# EAGLE design main_brd (EAGLE 6.4)
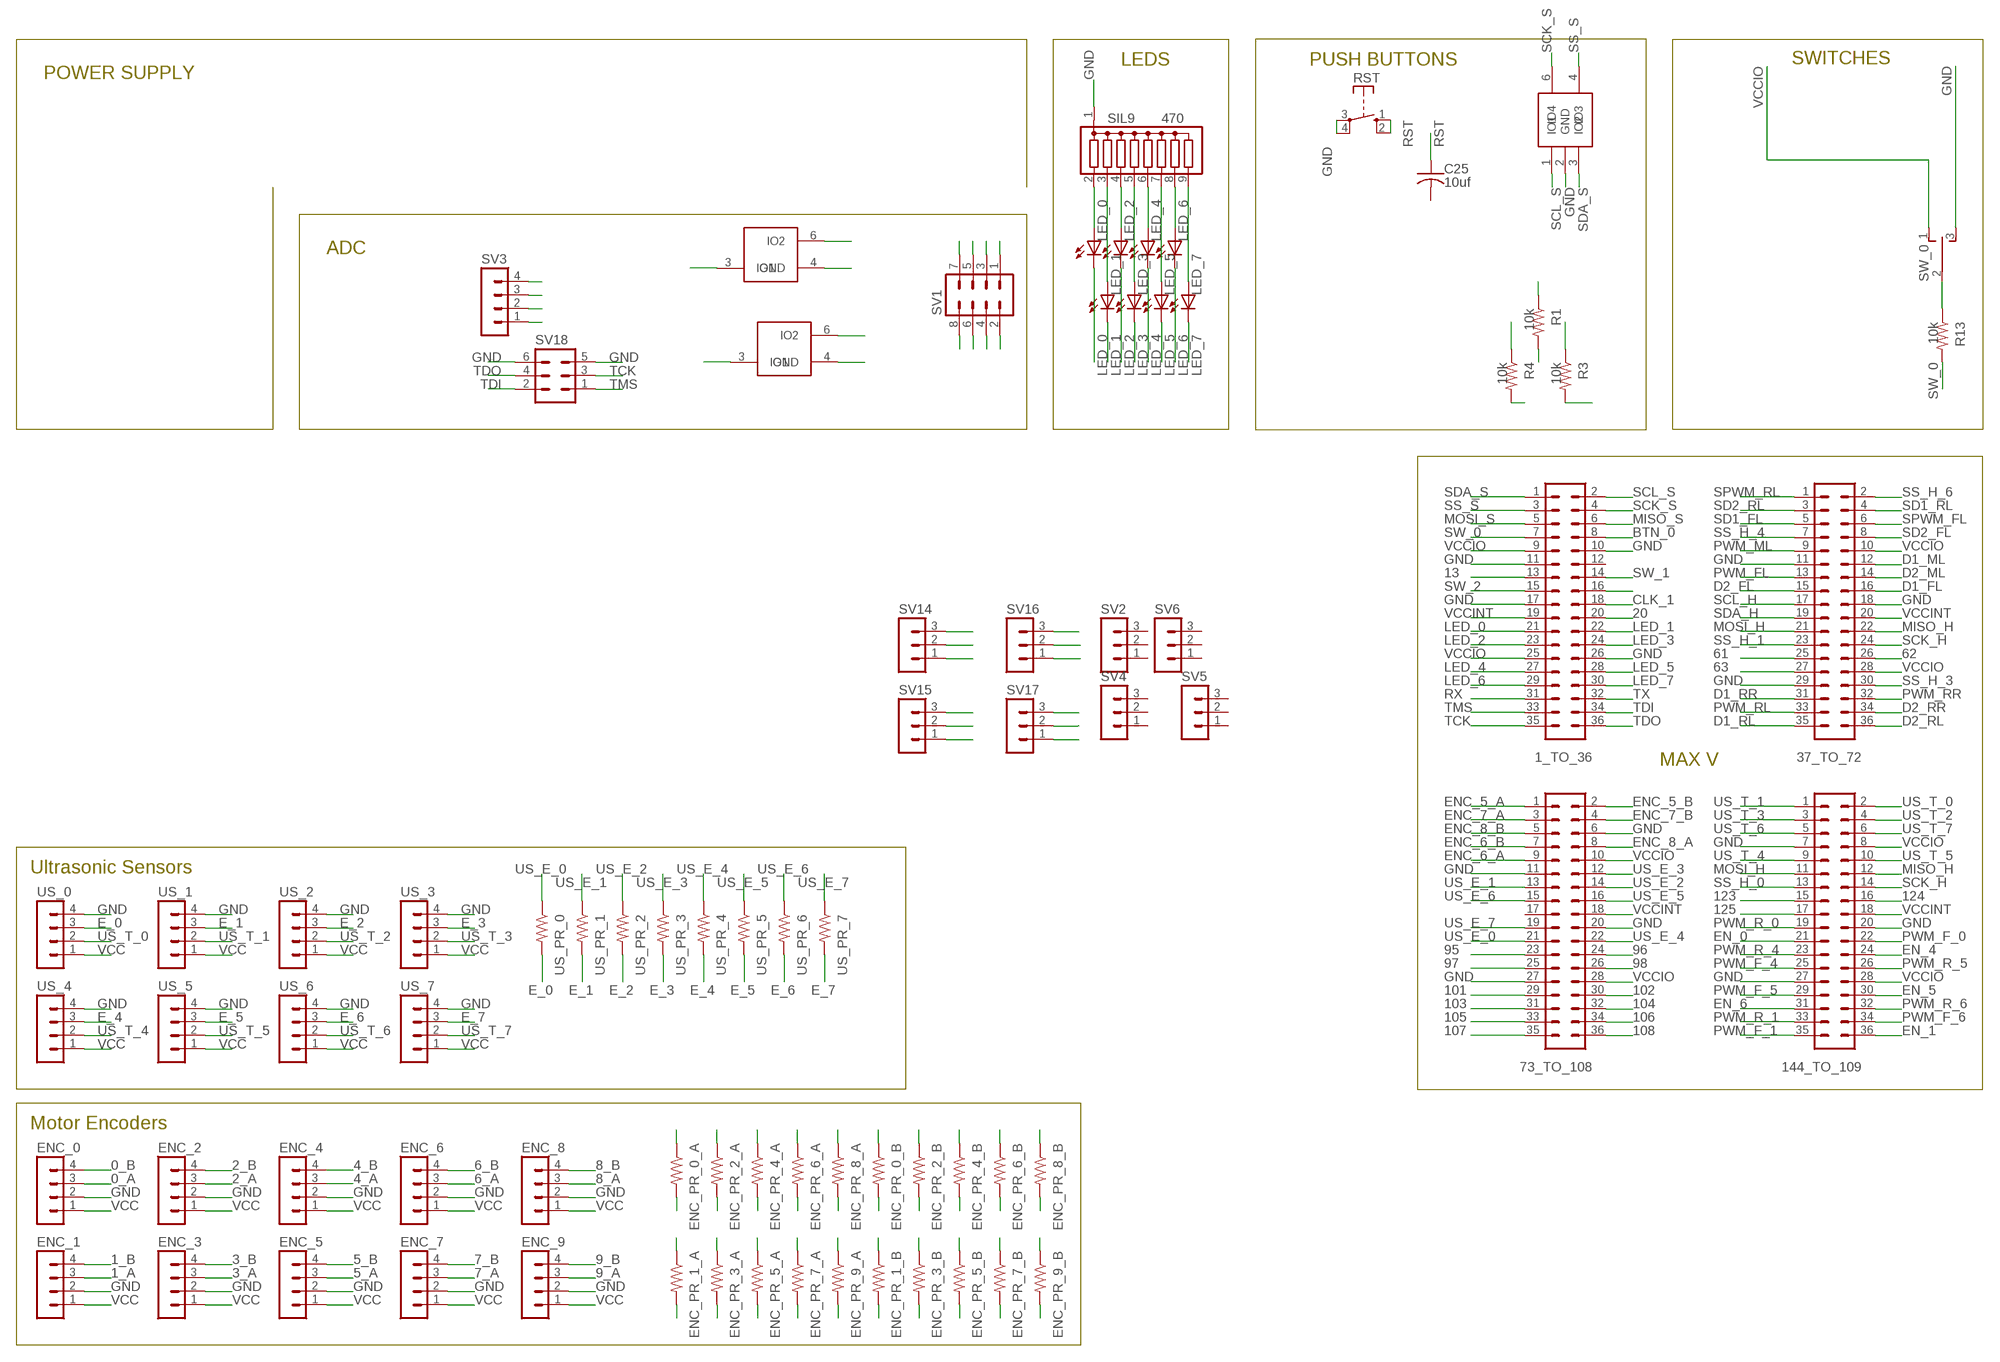
[diagram p0: schematic, sheet 1, part 1 of 2]
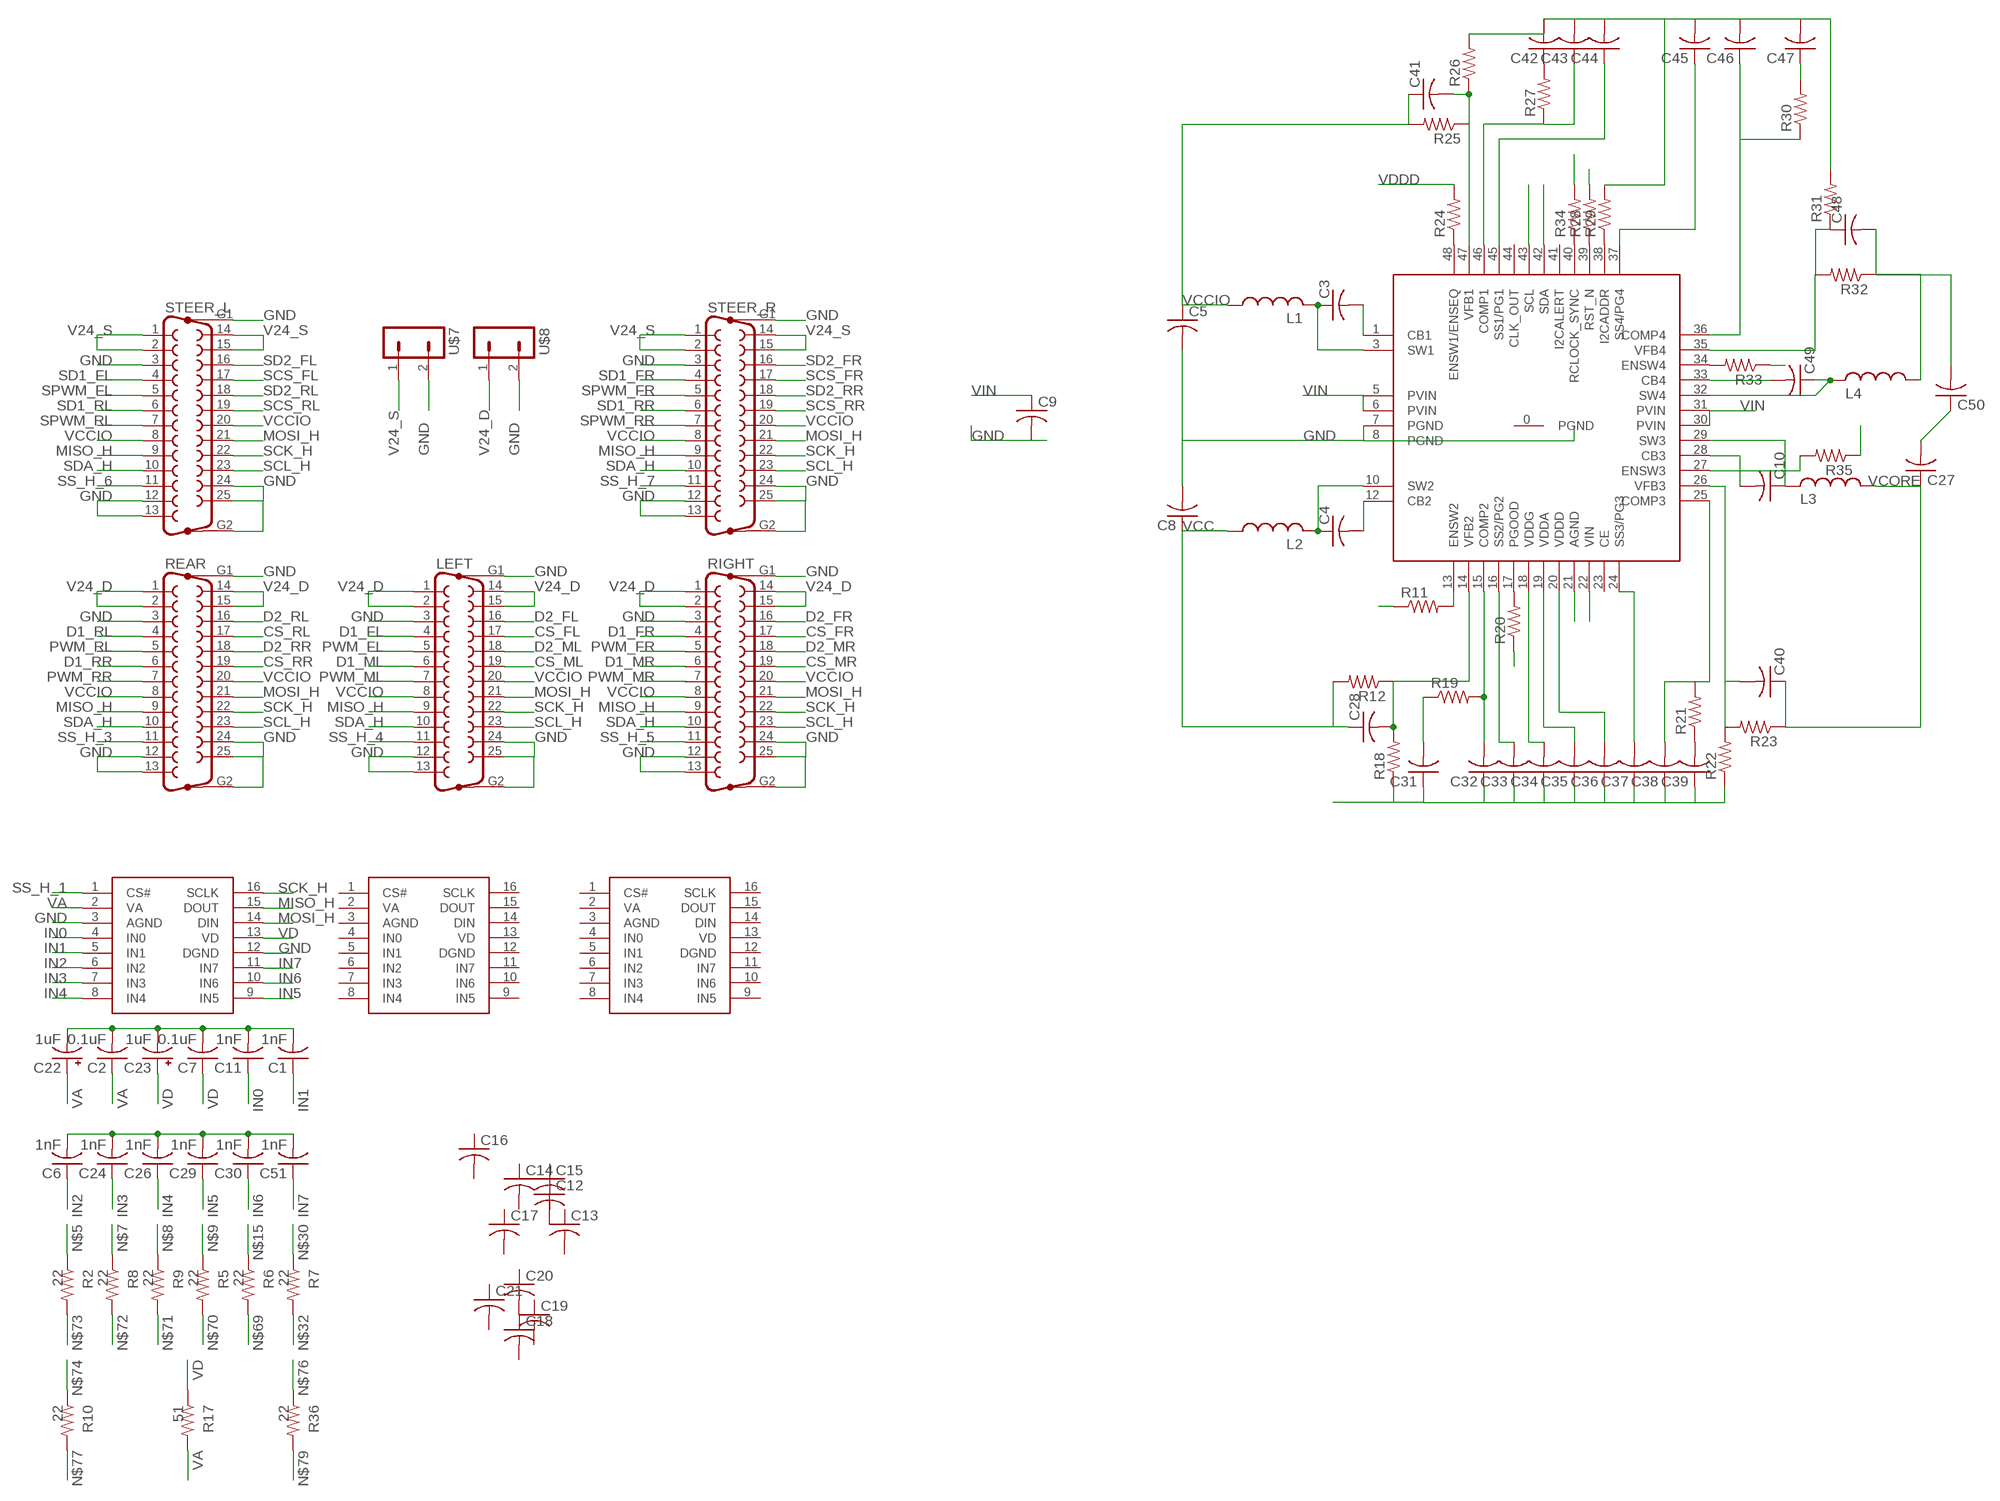
[diagram p1: schematic, sheet 1, part 2 of 2]

## Parts
1_TO_36  MA18-2  [MA18-2]
37_TO_72  MA18-2  [MA18-2]
73_TO_108  MA18-2  [MA18-2]
144_TO_109  MA18-2  [MA18-2]
C1  1nF  C-USC1206  [C1206]
C2  0.1uF  C-USC1206  [C1206]
C3  C-USC1206  [C1206]
C4  C-USC1206  [C1206]
C5  C-USC1206  [C1206]
C6  1nF  C-USC1206  [C1206]
C7  0.1uF  C-USC1206  [C1206]
C8  C-USC1206  [C1206]
C9  C-USC1206  [C1206]
C10  C-USC1206  [C1206]
C11  1nF  C-USC1206  [C1206]
C12  C-USC1206  [C1206]
C13  C-USC1206  [C1206]
C14  C-USC1206  [C1206]
C15  C-USC1206  [C1206]
C16  C-USC1206  [C1206]
C17  C-USC1206  [C1206]
C18  C-USC1206  [C1206]
C19  C-USC1206  [C1206]
C20  C-USC1206  [C1206]
C21  C-USC1206  [C1206]
C22  1uF  CPOL-USE1.8-4  [E1,8-4]
C23  1uF  CPOL-USE1.8-4  [E1,8-4]
C24  1nF  C-USC1206  [C1206]
C25  10uf  C-USC1206  [C1206]
C26  1nF  C-USC1206  [C1206]
C27  C-USC1206  [C1206]
C28  C-USC1206  [C1206]
C29  1nF  C-USC1206  [C1206]
C30  1nF  C-USC1206  [C1206]
C31  C-USC1206  [C1206]
C32  C-USC1206  [C1206]
C33  C-USC1206  [C1206]
C34  C-USC1206  [C1206]
C35  C-USC1206  [C1206]
C36  C-USC1206  [C1206]
C37  C-USC1206  [C1206]
C38  C-USC1206  [C1206]
C39  C-USC1206  [C1206]
C40  C-USC1206  [C1206]
C41  C-USC1206  [C1206]
C42  C-USC1206  [C1206]
C43  C-USC1206  [C1206]
C44  C-USC1206  [C1206]
C45  C-USC1206  [C1206]
C46  C-USC1206  [C1206]
C47  C-USC1206  [C1206]
C48  C-USC1206  [C1206]
C49  C-USC1206  [C1206]
C50  C-USC1206  [C1206]
C51  1nF  C-USC1206  [C1206]
ENC_0  MA04-1  [MA04-1]
ENC_1  MA04-1  [MA04-1]
ENC_2  MA04-1  [MA04-1]
ENC_3  MA04-1  [MA04-1]
ENC_4  MA04-1  [MA04-1]
ENC_5  MA04-1  [MA04-1]
ENC_6  MA04-1  [MA04-1]
ENC_7  MA04-1  [MA04-1]
ENC_8  MA04-1  [MA04-1]
ENC_9  MA04-1  [MA04-1]
ENC_PR_0_A  R-US_R1206  [R1206]
ENC_PR_0_B  R-US_R1206  [R1206]
ENC_PR_1_A  R-US_R1206  [R1206]
ENC_PR_1_B  R-US_R1206  [R1206]
ENC_PR_2_A  R-US_R1206  [R1206]
ENC_PR_2_B  R-US_R1206  [R1206]
ENC_PR_3_A  R-US_R1206  [R1206]
ENC_PR_3_B  R-US_R1206  [R1206]
ENC_PR_4_A  R-US_R1206  [R1206]
ENC_PR_4_B  R-US_R1206  [R1206]
ENC_PR_5_A  R-US_R1206  [R1206]
ENC_PR_5_B  R-US_R1206  [R1206]
ENC_PR_6_A  R-US_R1206  [R1206]
ENC_PR_6_B  R-US_R1206  [R1206]
ENC_PR_7_A  R-US_R1206  [R1206]
ENC_PR_7_B  R-US_R1206  [R1206]
ENC_PR_8_A  R-US_R1206  [R1206]
ENC_PR_8_B  R-US_R1206  [R1206]
ENC_PR_9_A  R-US_R1206  [R1206]
ENC_PR_9_B  R-US_R1206  [R1206]
L1  L-USL1206  [C1206]
L2  L-USL1206  [C1206]
L3  L-USL1206  [C1206]
L4  L-USL1206  [C1206]
LED_0  LEDSMT1206  [1206]
LED_1  LEDSMT1206  [1206]
LED_2  LEDSMT1206  [1206]
LED_3  LEDSMT1206  [1206]
LED_4  LEDSMT1206  [1206]
LED_5  LEDSMT1206  [1206]
LED_6  LEDSMT1206  [1206]
LED_7  LEDSMT1206  [1206]
LEFT  F25HP  [F25HP]
R1  10k  R-US_R1206  [R1206]
R2  22  R-US_R1206  [R1206]
R3  10k  R-US_R1206  [R1206]
R4  10k  R-US_R1206  [R1206]
R5  22  R-US_R1206  [R1206]
R6  22  R-US_R1206  [R1206]
R7  22  R-US_R1206  [R1206]
R8  22  R-US_R1206  [R1206]
R9  22  R-US_R1206  [R1206]
R10  22  R-US_R1206  [R1206]
R11  R-US_R1206  [R1206]
R12  R-US_R1206  [R1206]
R13  10k  R-US_R1206  [R1206]
R17  51  R-US_R1206  [R1206]
R18  R-US_R1206  [R1206]
R19  R-US_R1206  [R1206]
R20  R-US_R1206  [R1206]
R21  R-US_R1206  [R1206]
R22  R-US_R1206  [R1206]
R23  R-US_R1206  [R1206]
R24  R-US_R1206  [R1206]
R25  R-US_R1206  [R1206]
R26  R-US_R1206  [R1206]
R27  R-US_R1206  [R1206]
R28  R-US_R1206  [R1206]
R29  R-US_R1206  [R1206]
R30  R-US_R1206  [R1206]
R31  R-US_R1206  [R1206]
R32  R-US_R1206  [R1206]
R33  R-US_R1206  [R1206]
R34  R-US_R1206  [R1206]
R35  R-US_R1206  [R1206]
R36  22  R-US_R1206  [R1206]
REAR  F25HP  [F25HP]
RIGHT  F25HP  [F25HP]
RST  RACON12  [RACON12]
SIL9  470  G08R  [SIL9]
STEER_L  F25HP  [F25HP]
STEER_R  F25HP  [F25HP]
SV1  MA04-2  [MA04-2]
SV2  MA03-1  [MA03-1]
SV3  MA04-1  [MA04-1]
SV4  MA03-1  [MA03-1]
SV5  MA03-1  [MA03-1]
SV6  MA03-1  [MA03-1]
SV14  MA03-1  [MA03-1]
SV15  MA03-1  [MA03-1]
SV16  MA03-1  [MA03-1]
SV17  MA03-1  [MA03-1]
SV18  MA03-2  [MA03-2]
SW_0  TL39PO  [TL3XPO]
U$1  TPD4E1B06DCKR  [DCK6]
U$2  TPS65400RGZR  [VQFN48]
U$4  TPD2E2U06DRLR  [DRL5]
U$5  TPD2E2U06DRLR  [DRL5]
U$7  MB02-1  [MB03-1]
U$8  MB02-1  [MB03-1]
U$9  ADC128S052QCMT  [R-PDSO-G16]
U$10  ADC128S052QCMT  [R-PDSO-G16]
U$11  ADC128S052QCMT  [R-PDSO-G16]
US_0  MA04-1  [MA04-1]
US_1  MA04-1  [MA04-1]
US_2  MA04-1  [MA04-1]
US_3  MA04-1  [MA04-1]
US_4  MA04-1  [MA04-1]
US_5  MA04-1  [MA04-1]
US_6  MA04-1  [MA04-1]
US_7  MA04-1  [MA04-1]
US_PR_0  R-US_R1206  [R1206]
US_PR_1  R-US_R1206  [R1206]
US_PR_2  R-US_R1206  [R1206]
US_PR_3  R-US_R1206  [R1206]
US_PR_4  R-US_R1206  [R1206]
US_PR_5  R-US_R1206  [R1206]
US_PR_6  R-US_R1206  [R1206]
US_PR_7  R-US_R1206  [R1206]

## Nets
0_A: ENC_0.3 ENC_PR_0_A.2
0_B: ENC_0.4 ENC_PR_0_B.2
1_A: ENC_1.3 ENC_PR_1_A.2
1_B: ENC_1.4 ENC_PR_1_B.2
2_A: ENC_2.3 ENC_PR_2_A.2
2_B: ENC_2.4 ENC_PR_2_B.2
3_A: ENC_3.3 ENC_PR_3_A.2
3_B: ENC_3.4 ENC_PR_3_B.2
4_A: ENC_4.3 ENC_PR_4_A.2
4_B: ENC_4.4 ENC_PR_4_B.2
5_A: ENC_5.3 ENC_PR_5_A.2
5_B: ENC_5.4 ENC_PR_5_B.2
6_A: ENC_6.3 ENC_PR_6_A.2
6_B: ENC_6.4 ENC_PR_6_B.2
7_A: ENC_7.3 ENC_PR_7_A.2
7_B: ENC_7.4 ENC_PR_7_B.2
8_A: ENC_8.3 ENC_PR_8_A.2
8_B: ENC_8.4 ENC_PR_8_B.2
9_A: ENC_9.3 ENC_PR_9_A.2
9_B: ENC_9.4 ENC_PR_9_B.2
13: 1_TO_36.13
20: 1_TO_36.20
61: 37_TO_72.25
62: 37_TO_72.26
63: 37_TO_72.27
95: 73_TO_108.23
96: 73_TO_108.24
97: 73_TO_108.25
98: 73_TO_108.26
101: 73_TO_108.29
102: 73_TO_108.30
103: 73_TO_108.31
104: 73_TO_108.32
105: 73_TO_108.33
106: 73_TO_108.34
107: 73_TO_108.35
108: 73_TO_108.36
123: 144_TO_109.15
124: 144_TO_109.16
125: 144_TO_109.17
BTN: U$4.6(IO2)
BTN_0: 1_TO_36.8
CLK_1: 1_TO_36.18
CS_FL: LEFT.17
CS_FR: RIGHT.17
CS_ML: LEFT.19
CS_MR: RIGHT.19
CS_RL: REAR.17
CS_RR: REAR.19
D1_FL: 37_TO_72.16 LEFT.4
D1_FR: RIGHT.4
D1_ML: 37_TO_72.12 LEFT.6
D1_MR: RIGHT.6
D1_RL: 37_TO_72.35 REAR.4
D1_RR: 37_TO_72.31 REAR.6
D2_FL: 37_TO_72.15 LEFT.16
D2_FR: RIGHT.16
D2_ML: 37_TO_72.14 LEFT.18
D2_MR: RIGHT.18
D2_RL: 37_TO_72.36 REAR.16
D2_RR: 37_TO_72.34 REAR.18
E_0: US_0.3 US_PR_0.2
E_1: US_1.3 US_PR_1.2
E_2: US_2.3 US_PR_2.2
E_3: US_3.3 US_PR_3.2
E_4: US_4.3 US_PR_4.2
E_5: US_5.3 US_PR_5.2
E_6: US_6.3 US_PR_6.2
E_7: US_7.3 US_PR_7.2
EN_0: 144_TO_109.21
EN_1: 144_TO_109.36
EN_4: 144_TO_109.24
EN_5: 144_TO_109.30
EN_6: 144_TO_109.31
ENC_0_A: ENC_PR_0_A.1
ENC_0_B: ENC_PR_0_B.1
ENC_1_A: ENC_PR_1_A.1
ENC_1_B: ENC_PR_1_B.1
ENC_2_A: ENC_PR_2_A.1
ENC_2_B: ENC_PR_2_B.1
ENC_3_A: ENC_PR_3_A.1
ENC_3_B: ENC_PR_3_B.1
ENC_4_A: ENC_PR_4_A.1
ENC_4_B: ENC_PR_4_B.1
ENC_5_A: 73_TO_108.1 ENC_PR_5_A.1
ENC_5_B: 73_TO_108.2 ENC_PR_5_B.1
ENC_6_A: 73_TO_108.9 ENC_PR_6_A.1
ENC_6_B: 73_TO_108.7 ENC_PR_6_B.1
ENC_7_A: 73_TO_108.3 ENC_PR_7_A.1
ENC_7_B: 73_TO_108.4 ENC_PR_7_B.1
ENC_8_A: 73_TO_108.8 ENC_PR_8_A.1
ENC_8_B: 73_TO_108.5 ENC_PR_8_B.1
ENC_9_A: ENC_PR_9_A.1
ENC_9_B: ENC_PR_9_B.1
ENSW3: R35.2 U$2.27(ENSW3)
ENSW4: R33.2 U$2.34(ENSW4)
GND: 1_TO_36.10 1_TO_36.11 1_TO_36.17 1_TO_36.26 37_TO_72.11 37_TO_72.18 37_TO_72.29 73_TO_108.6 73_TO_108.11 73_TO_108.20 73_TO_108.27 144_TO_109.7 144_TO_109.20 144_TO_109.27 C1.2 C2.2 C5.2 C7.2 C8.2 C9.2 C11.2 C22.- C23.- C27.2 C31.1 C32.1 C33.1 C34.1 C35.1 C36.1 C37.1 C38.1 C39.1 C42.2 C43.2 C44.2 C45.2 C46.2 C47.2 ENC_0.2 ENC_1.2 ENC_2.2 ENC_3.2 ENC_4.2 ENC_5.2 ENC_6.2 ENC_7.2 ENC_8.2 ENC_9.2 LEFT.3 LEFT.12 LEFT.13 LEFT.24 LEFT.25 LEFT.G1 LEFT.G2 R18.1 R22.1 R26.2 R29.2 R31.2 R34.2 REAR.3 REAR.12 REAR.13 REAR.24 REAR.25 REAR.G1 REAR.G2 RIGHT.3 RIGHT.12 RIGHT.13 RIGHT.24 RIGHT.25 RIGHT.G1 RIGHT.G2 RST.3(P) RST.4(P) SIL9.1 STEER_L.3 STEER_L.12 STEER_L.13 STEER_L.24 STEER_L.25 STEER_L.G1 STEER_L.G2 STEER_R.3 STEER_R.12 STEER_R.13 STEER_R.24 STEER_R.25 STEER_R.G1 STEER_R.G2 SV1.7 SV1.8 SV3.2 SV14.3 SV15.3 SV16.3 SV17.3 SV18.5 SV18.6 SW_0.3(S) U$1.2(GND) U$2.7(PGND) U$2.8(PGND) U$2.21(AGND) U$4.4(GND) U$5.4(GND) U$7.2 U$8.2 U$9.3(AGND) U$9.12(DGND) US_0.4 US_1.4 US_2.4 US_3.4 US_4.4 US_5.4 US_6.4 US_7.4
IN0: C11.1 U$9.4(IN0)
IN1: C1.1 U$9.5(IN1)
IN2: C6.1 U$9.6(IN2)
IN3: C24.1 U$9.7(IN3)
IN4: C26.1 U$9.8(IN4)
IN5: C29.1 U$9.9(IN5)
IN6: C30.1 U$9.10(IN6)
IN7: C51.1 U$9.11(IN7)
LED_0: 1_TO_36.21 LED_0.C
LED_1: 1_TO_36.22 LED_1.C
LED_2: 1_TO_36.23 LED_2.C
LED_3: 1_TO_36.24 LED_3.C
LED_4: 1_TO_36.27 LED_4.C
LED_5: 1_TO_36.28 LED_5.C
LED_6: 1_TO_36.29 LED_6.C
LED_7: 1_TO_36.30 LED_7.C
MISO_H: 37_TO_72.22 144_TO_109.12 LEFT.9 REAR.9 RIGHT.9 STEER_L.9 STEER_R.9 U$9.15(DOUT)
MISO_S: 1_TO_36.6 SV1.5 U$5.3(IO1)
MOSI_H: 37_TO_72.21 144_TO_109.11 LEFT.21 REAR.21 RIGHT.21 STEER_L.21 STEER_R.21 U$9.14(DIN)
MOSI_S: 1_TO_36.5 SV1.6 U$5.6(IO2)
N$3: C4.1 L2.2 U$2.10(SW2)
N$4: C18.1 C20.2
N$5: R2.1
N$7: R8.1
N$8: R9.1
N$9: R5.1
N$10: C3.2 U$2.1(CB1)
N$11: C3.1 L1.2 U$2.3(SW1)
N$12: C4.2 U$2.12(CB2)
N$13: C10.1 L3.2 U$2.29(SW3)
N$14: C10.2 U$2.28(CB3)
N$15: R6.1
N$16: R11.2 U$2.13(ENSW2)
N$17: C28.2 R12.1 R18.2 U$2.14(VFB2)
N$18: C32.2 R19.2 U$2.15(COMP2)
N$19: LED_0.A SIL9.2
N$21: LED_4.A SIL9.6
N$22: LED_6.A SIL9.8
N$23: LED_1.A SIL9.3
N$24: LED_3.A SIL9.5
N$25: LED_5.A SIL9.7
N$26: LED_7.A SIL9.9
N$27: C31.2 R19.1
N$28: R13.1 SW_0.2(P)
N$29: R20.2 U$2.17(PGOOD)
N$30: R7.1
N$31: C6.2 C24.2 C26.2 C29.2 C30.2 C51.2
N$32: R7.2
N$35: C34.2 U$2.18(VDDG)
N$36: C35.2 U$2.19(VDDA)
N$37: C39.2 R21.1
N$38: C40.2 R22.2 R23.2 U$2.26(VFB3)
N$39: C38.2 R21.2 U$2.25(COMP3)
N$40: R24.1 U$2.48(ENSW1/ENSEQ)
N$41: C37.2 U$2.24(SS3/PG3)
N$44: C33.2 U$2.16(SS2/PG2)
N$47: C42.1 R27.2
N$54: R29.1 U$2.38(I2CADDR)
N$55: C48.1 R31.1 R32.2 U$2.35(VFB4)
N$57: C49.1 L4.2 U$2.32(SW4)
N$58: C41.2 R25.1 R26.1 U$2.47(VFB1)
N$59: C45.1 U$2.37(SS4/PG4)
N$60: C46.1 R30.1 U$2.36(COMP4)
N$61: C47.1 R30.2
N$62: C43.1 R27.1 U$2.46(COMP1)
N$63: C44.1 U$2.45(SS1/PG1)
N$65: C49.2 U$2.33(CB4)
N$66: R34.1 U$2.40(RCLOCK_SYNC)
N$69: R6.2
N$70: R5.2
N$71: R9.2
N$72: R8.2
N$73: R2.2
N$74: R10.1
N$76: R36.1
N$77: R10.2
N$79: R36.2
POT_0: SV14.2
POT_1: SV15.2
POT_2: SV16.2
POT_3: SV17.2
PWM_F_0: 144_TO_109.22
PWM_F_1: 144_TO_109.35
PWM_F_4: 144_TO_109.25
PWM_F_5: 144_TO_109.29
PWM_F_6: 144_TO_109.34
PWM_FL: 37_TO_72.13 LEFT.5
PWM_FR: RIGHT.5
PWM_ML: 37_TO_72.9 LEFT.7
PWM_MR: RIGHT.7
PWM_R_0: 144_TO_109.19
PWM_R_1: 144_TO_109.33
PWM_R_4: 144_TO_109.23
PWM_R_5: 144_TO_109.26
PWM_R_6: 144_TO_109.32
PWM_RL: 37_TO_72.33 REAR.5
PWM_RR: 37_TO_72.32 REAR.7
RST: C25.1 R1.1 RST.1(S) RST.2(S) U$4.3(IO1)
RST_N: R28.1 U$2.39(RST_N)
RX: 1_TO_36.31 SV3.3
SCK_H: 37_TO_72.24 144_TO_109.14 LEFT.22 REAR.22 RIGHT.22 STEER_L.22 STEER_R.22 U$9.16(SCLK)
SCK_S: 1_TO_36.4 SV1.3 U$1.6(IO4)
SCL_H: 37_TO_72.17 LEFT.23 REAR.23 RIGHT.23 STEER_L.23 STEER_R.23
SCL_S: 1_TO_36.2 R4.1 SV1.1 U$1.1(IO1) U$2.43(SCL)
SCS_FL: STEER_L.17
SCS_FR: STEER_R.17
SCS_RL: STEER_L.19
SCS_RR: STEER_R.19
SD1_FL: 37_TO_72.5 STEER_L.4
SD1_FR: STEER_R.4
SD1_RL: 37_TO_72.4 STEER_L.6
SD1_RR: STEER_R.6
SD2_FL: 37_TO_72.8 STEER_L.16
SD2_FR: STEER_R.16
SD2_RL: 37_TO_72.3 STEER_L.18
SD2_RR: STEER_R.18
SDA_H: 37_TO_72.19 LEFT.10 REAR.10 RIGHT.10 STEER_L.10 STEER_R.10
SDA_S: 1_TO_36.1 R3.1 SV1.2 U$1.3(IO2) U$2.42(SDA)
SIL10: LED_2.A SIL9.4
SPWM_FL: 37_TO_72.6 STEER_L.5
SPWM_FR: STEER_R.5
SPWM_RL: 37_TO_72.1 STEER_L.7
SPWM_RR: STEER_R.7
SS_H_0: 144_TO_109.13
SS_H_1: 37_TO_72.23 U$9.1(CS#)
SS_H_3: 37_TO_72.30 REAR.11
SS_H_4: 37_TO_72.7 LEFT.11
SS_H_5: RIGHT.11
SS_H_6: 37_TO_72.2 STEER_L.11
SS_H_7: STEER_R.11
SS_S: 1_TO_36.3 SV1.4 U$1.4(IO3)
SW_0: 1_TO_36.7 R13.2
SW_1: 1_TO_36.14
SW_2: 1_TO_36.15
SW_3: 1_TO_36.16
TCK: 1_TO_36.35 SV18.3
TDI: 1_TO_36.34 SV18.2
TDO: 1_TO_36.36 SV18.4
TMS: 1_TO_36.33 SV18.1
TX: 1_TO_36.32 SV3.1
US_E_0: 73_TO_108.21 US_PR_0.1
US_E_1: 73_TO_108.13 US_PR_1.1
US_E_2: 73_TO_108.14 US_PR_2.1
US_E_3: 73_TO_108.12 US_PR_3.1
US_E_4: 73_TO_108.22 US_PR_4.1
US_E_5: 73_TO_108.16 US_PR_5.1
US_E_6: 73_TO_108.15 US_PR_6.1
US_E_7: 73_TO_108.19 US_PR_7.1
US_T_0: 144_TO_109.2 US_0.2
US_T_1: 144_TO_109.1 US_1.2
US_T_2: 144_TO_109.4 US_2.2
US_T_3: 144_TO_109.3 US_3.2
US_T_4: 144_TO_109.9 US_4.2
US_T_5: 144_TO_109.10 US_5.2
US_T_6: 144_TO_109.5 US_6.2
US_T_7: 144_TO_109.6 US_7.2
V24_D: LEFT.1 LEFT.2 LEFT.14 LEFT.15 REAR.1 REAR.2 REAR.14 REAR.15 RIGHT.1 RIGHT.2 RIGHT.14 RIGHT.15 U$8.1
V24_S: STEER_L.1 STEER_L.2 STEER_L.14 STEER_L.15 STEER_R.1 STEER_R.2 STEER_R.14 STEER_R.15 U$7.1
VA: C2.1 C22.+ R17.2 U$9.2(VA)
VCC: C8.1 C28.1 ENC_0.1 ENC_1.1 ENC_2.1 ENC_3.1 ENC_4.1 ENC_5.1 ENC_6.1 ENC_7.1 ENC_8.1 ENC_9.1 L2.1 R12.2 SV14.1 SV15.1 SV16.1 SV17.1 US_0.1 US_1.1 US_2.1 US_3.1 US_4.1 US_5.1 US_6.1 US_7.1
VCCINT: 1_TO_36.19 37_TO_72.20 73_TO_108.18 144_TO_109.18 C48.2 C50.2 L4.1 R32.1
VCCIO: 1_TO_36.9 1_TO_36.25 37_TO_72.10 37_TO_72.28 73_TO_108.10 73_TO_108.28 144_TO_109.8 144_TO_109.28 C5.1 C41.1 L1.1 LEFT.8 LEFT.20 R1.2 R3.2 R4.2 R25.2 REAR.8 REAR.20 RIGHT.8 RIGHT.20 STEER_L.8 STEER_L.20 STEER_R.8 STEER_R.20 SV3.4 SW_0.1(O)
VCORE: C27.1 C40.1 L3.1 R23.1
VD: C7.1 C23.+ R17.1 U$9.13(VD)
VDDD: C36.2 R11.1 R20.1 R24.2 R28.2 R33.1 R35.1 U$2.20(VDDD)
VIN: C9.1 U$2.5(PVIN) U$2.6(PVIN) U$2.22(VIN) U$2.30(PVIN) U$2.31(PVIN)
Unconnected: 1_TO_36.12 73_TO_108.17 C12.1 C12.2 C13.1 C13.2 C14.1 C14.2 C15.1 C15.2 C16.1 C16.2 C17.1 C17.2 C18.2 C19.1 C19.2 C20.1 C21.1 C21.2 C25.2 C50.1 SV2.1 SV2.2 SV2.3 SV4.1 SV4.2 SV4.3 SV5.1 SV5.2 SV5.3 SV6.1 SV6.2 SV6.3 U$2.0(PGND) U$2.23(CE) U$2.41(I2CALERT) U$2.44(CLK_OUT) U$10.1(CS#) U$10.2(VA) U$10.3(AGND) U$10.4(IN0) U$10.5(IN1) U$10.6(IN2) U$10.7(IN3) U$10.8(IN4) U$10.9(IN5) U$10.10(IN6) U$10.11(IN7) U$10.12(DGND) U$10.13(VD) U$10.14(DIN) U$10.15(DOUT) U$10.16(SCLK) U$11.1(CS#) U$11.2(VA) U$11.3(AGND) U$11.4(IN0) U$11.5(IN1) U$11.6(IN2) U$11.7(IN3) U$11.8(IN4) U$11.9(IN5) U$11.10(IN6) U$11.11(IN7) U$11.12(DGND) U$11.13(VD) U$11.14(DIN) U$11.15(DOUT) U$11.16(SCLK)

## Notes on the sheet
- LEDS | PUSH BUTTONS | SWITCHES
- POWER SUPPLY
- ADC
- MAX V
- Ultrasonic Sensors
- Motor Encoders

## Library data of the parts
1_TO_36 37_TO_72 73_TO_108 144_TO_109 = con-lstb:MA18-2: PIN HEADER; OC_FARNELL: unknown; OC_NEWARK: unknown
C1-C21 C24 C26-C51 = rcl:C-US: CAPACITOR, American symbol
C22 C23 = resistor:CPOL-US: POLARIZED CAPACITOR, American symbol
C25 = resistor:C-US: CAPACITOR, American symbol
ENC_0 ENC_1-ENC_9 SV3 US_0 US_1-US_7 = con-lstb:MA04-1: PIN HEADER; OC_FARNELL: unknown; OC_NEWARK: unknown
ENC_PR_0_A ENC_PR_0_B ENC_PR_1_A ENC_PR_1_B ENC_PR_2_A ENC_PR_2_B ENC_PR_3_A ENC_PR_3_B ENC_PR_4_A ENC_PR_4_B ENC_PR_5_A ENC_PR_5_B ENC_PR_6_A ENC_PR_6_B ENC_PR_7_A ENC_PR_7_B ENC_PR_8_A ENC_PR_8_B ENC_PR_9_A ENC_PR_9_B R1-R10 R13 R17 R36 US_PR_0 US_PR_1-US_PR_7 = resistor:R-US_: RESISTOR, American symbol
L1-L4 = rcl:L-US: INDUCTOR, American symbol
LED_0 LED_1-LED_7 = led:LED: LED OSRAM: - CHIPLED LG R971, LG N971, LY N971, LG Q971, LY Q971, LO R971, LY R971 LH N974, LH R974 LS Q976, LO Q976, LY Q976 LO Q996 - Hyper CHIPLED LW Q18S LB Q993, LB Q99A, LB R99A - SideLED LS A670, LO A670, LY A670, LG A670, LP A670 LB A673, LV A673, LT A673, LW A673 LH A674 LY A675 LS A676, LA A676, LO A676, LY A676, LW A676 LS A679, LY A679, LG A679 - Hyper Micro SIDELED® LS Y876, LA Y876, LO Y876, LY Y876 LT Y87S - SmartLED LW L88C, LW L88S LB L89C, LB L89S, LG L890 LS L89K, LO L89K, LY L89K LS L896, LA L896, LO L896, LY L896 - TOPLED LS T670, LO T670, LY T670, LG T670, LP T670 LSG T670, LSP T670, LSY T670, LOP T670, LYG T670 LG T671, LOG T671, LSG T671 LB T673, LV T673, LT T673, LW T673 LH T674 LS T676, LA T676, LO T676, LY T676, LB T676, LH T676, LSB T676, LW T676 LB T67C, LV T67C, LT T67C, LS T67K, LO T67K, LY T67K, LW E67C LS E67B, LA E67B, LO E67B, LY E67B, LB E67C, LV E67C, LT E67C LW T67C LS T679, LY T679, LG T679 LS T770, LO T770, LY T770, LG T770, LP T770 LB T773, LV T773, LT T773, LW T773 LH T774 LS E675, LA E675, LY E675, LS T675 LS T776, LA T776, LO T776, LY T776, LB T776 LHGB T686 LT T68C, LB T68C - Hyper Mini TOPLED® LB M676 - Mini TOPLED Santana® LG M470 LS M47K, LO M47K, LY M47K Source: http://www.osram.convergy.de - LUMILED® LXK2-PW12-R00, LXK2-PW12-S00, LXK2-PW14-U00, LXK2-PW14-V00 LXK2-PM12-R00, LXK2-PM12-S00, LXK2-PM14-U00 LXK2-PE12-Q00, LXK2-PE12-R00, LXK2-PE12-S00, LXK2-PE14-T00, LXK2-PE14-U00 LXK2-PB12-K00, LXK2-PB12-L00, LXK2-PB12-M00, LXK2-PB14-N00, LXK2-PB14-P00, LXK2-PB14-Q00 LXK2-PR12-L00, LXK2-PR12-M00, LXK2-PR14-Q00, LXK2-PR14-R00 LXK2-PD12-Q00, LXK2-PD12-R00, LXK2-PD12-S00 LXK2-PH12-R00, LXK2-PH12-S00 LXK2-PL12-P00, LXK2-PL12-Q00, LXK2-PL12-R00 Source: www.luxeon.com
LEFT REAR RIGHT STEER_L STEER_R = con-subd:F25HP: SUB-D; OC_FARNELL: unknown; OC_NEWARK: unknown
R11 R12 R18-R35 = rcl:R-US_: RESISTOR, American symbol
RST = switch-misc:RACON12: ITT SWITCH
SIL9 = resistor-sil:G08R: SIL RESISTOR
SV1 = con-lstb:MA04-2: PIN HEADER; OC_FARNELL: unknown; OC_NEWARK: unknown
SV2 SV4-SV6 SV14-SV17 = con-lstb:MA03-1: PIN HEADER; OC_FARNELL: unknown; OC_NEWARK: unknown
SV18 = con-lstb:MA03-2: PIN HEADER; OC_FARNELL: unknown; OC_NEWARK: unknown
SW_0 = switch:TL39PO: TINY SWITCH ON OFF ON Source: http://www2.produktinfo.conrad.com/datenblaetter/700000-724999/705152-da-01-de-Subminiaturschalter_TL_36YO.pdf
U$1 = ti-esd:TPD4E1B06: Texas Intstruments ESD Protection Solutions
U$2 = ti-power:TPS65400: Quad 4A/4A/2A/2A buck converter
U$4 U$5 = ti-esd:TPD2E2U06: Texas Intstruments ESD Protection Solutions
U$7 U$8 = kamal:MB02-1
U$9-U$11 = kamal:ADC128S052

## Board
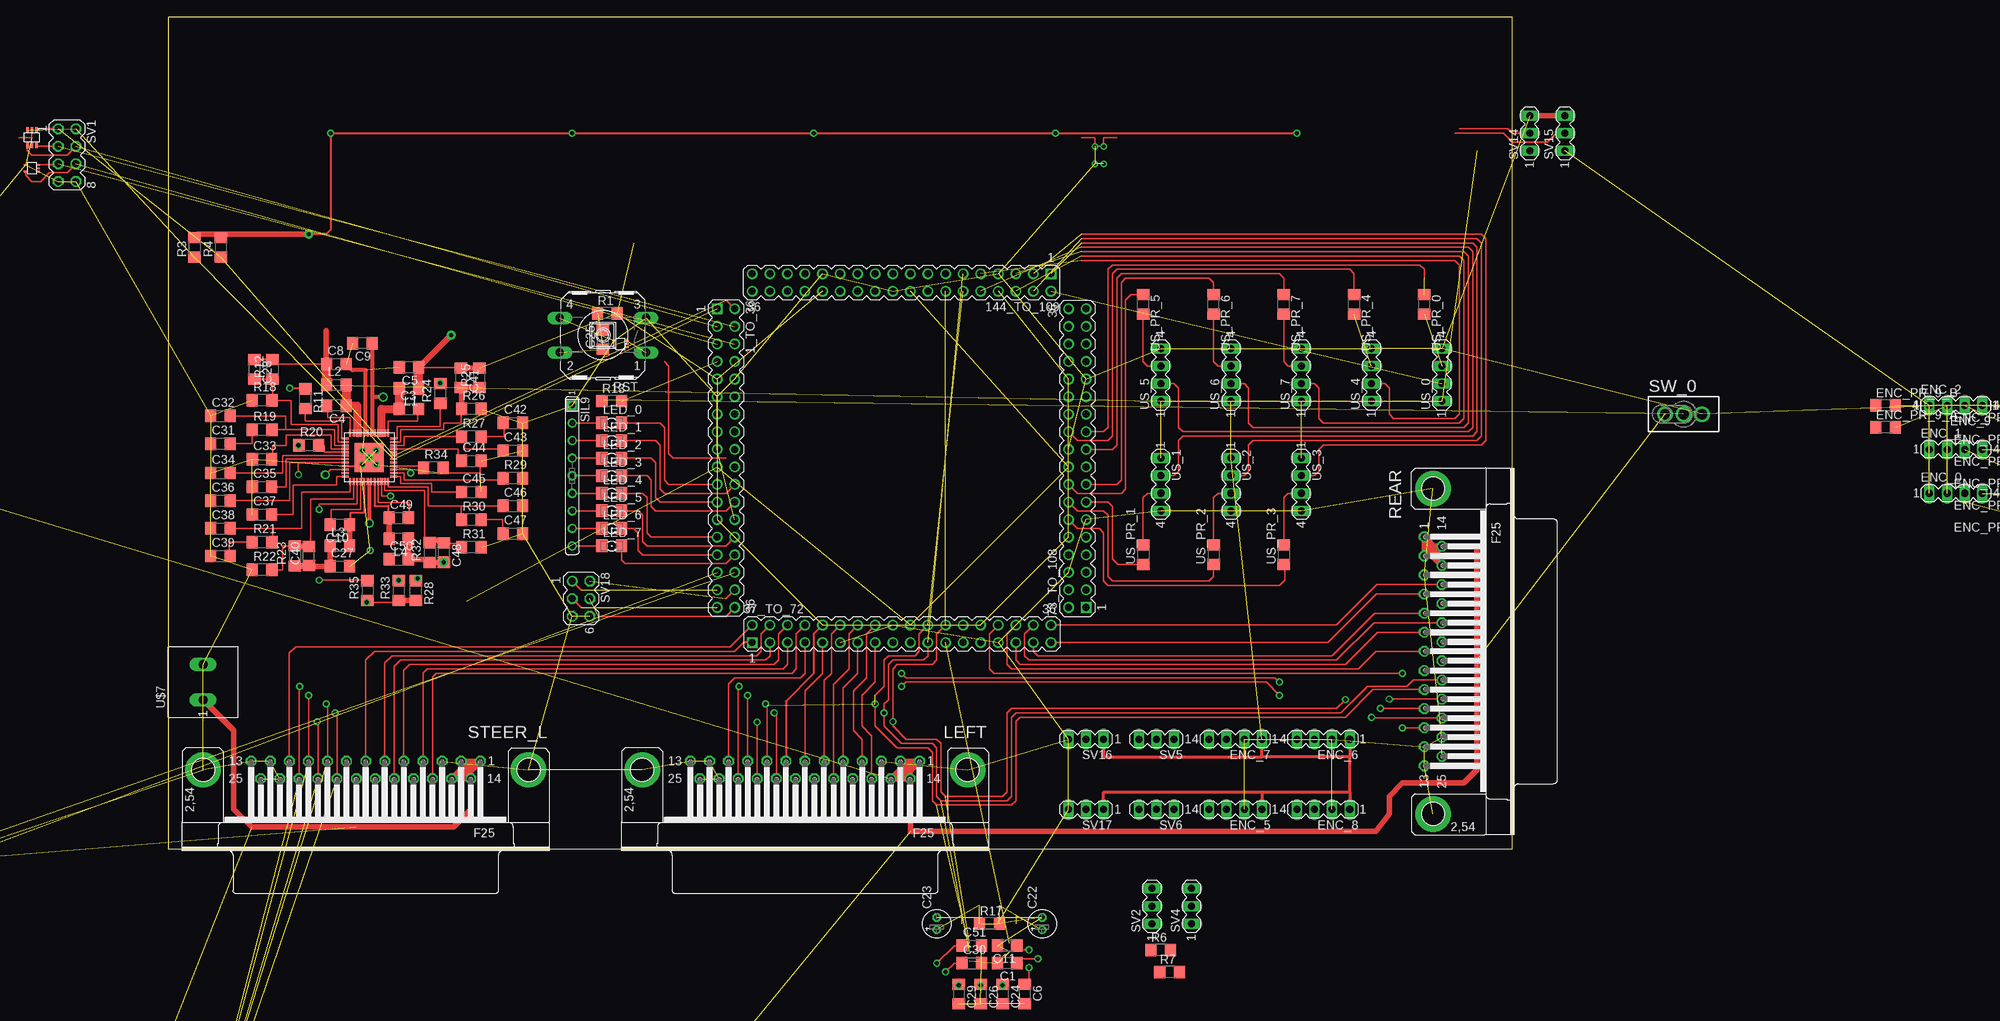
[diagram p2: board, top side]
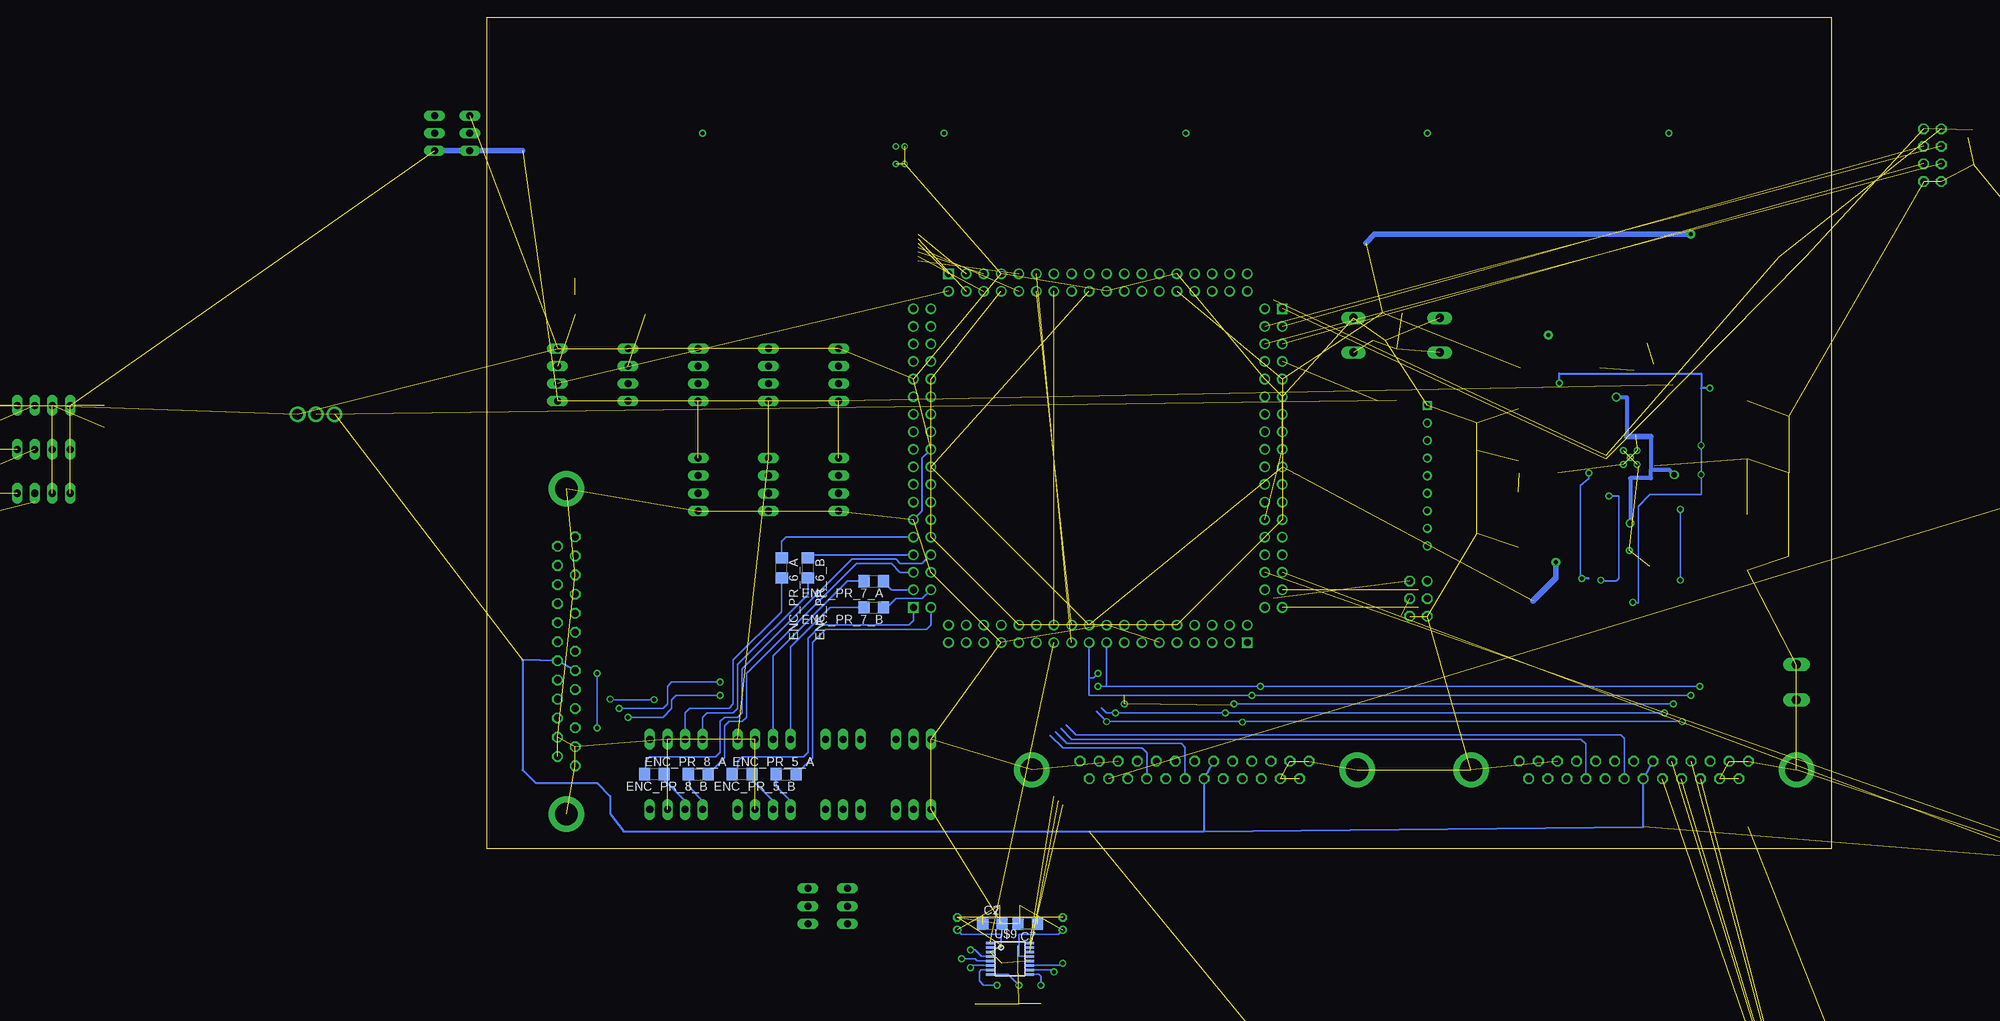
[diagram p3: board, bottom side, seen from below]

Size 194.36 x 120.26 mm. Coordinates in mm from the lower left corner, seen from the top.
Outline: 0,0 194.36,0 194.36,120.26 0,120.26 0,0
Copper layers (1*16): Top 0.035mm / dielectric 1.5mm / Bottom 0.035mm
Design rules "default": minimum track width 10mil, minimum drill 24mil, track to track 8mil, track to pad 8mil, pad to pad 8mil, via to via 8mil, smd to smd 8mil, copper to edge 40mil, drill to drill 8mil, minimum pad ring 10mil, minimum via ring 8mil, stop-mask expansion 4mil, vias tented up to drill 0mil, thermal gap 10mil

### Footprints (pad centres in the part's own frame; a part is rotated, then mirrored left to right if it is on the bottom)
MA18-2 = drill 1.016 square: 1 -21.59,-1.27 | drill 1.016: 2 -21.59,1.27; 3 -19.05,-1.27; 4 -19.05,1.27; 5 -16.51,-1.27; 6 -16.51,1.27; 7 -13.97,-1.27; 8 -13.97,1.27; 9 -11.43,-1.27; 10 -11.43,1.27; 11 -8.89,-1.27; 12 -8.89,1.27; 13 -6.35,-1.27; 14 -6.35,1.27; 15 -3.81,-1.27; 16 -3.81,1.27; 17 -1.27,-1.27; 18 -1.27,1.27; 19 1.27,-1.27; 20 1.27,1.27; 21 3.81,-1.27; 22 3.81,1.27; 23 6.35,-1.27; 24 6.35,1.27; 25 8.89,-1.27; 26 8.89,1.27; 27 11.43,-1.27; 28 11.43,1.27; 29 13.97,-1.27; 30 13.97,1.27; 31 16.51,-1.27; 32 16.51,1.27; 33 19.05,-1.27; 34 19.05,1.27; 35 21.59,-1.27; 36 21.59,1.27
C1206 = smd 1.6 x 1.8: 1 -1.4,0; 2 1.4,0
E1,8-4 = drill 0.711 pad 1.168: + -0.889,0 | drill 0.711 pad 1.168 octagon: - 0.889,0
MA04-1 = drill 1.016 long: 1 -3.81,0; 2 -1.27,0; 3 1.27,0; 4 3.81,0
R1206 = smd 1.6 x 1.803: 1 -1.422,0; 2 1.422,0
1206 = smd 1.6 x 1.803: A -1.422,0; C 1.422,0
F25HP = drill 1.016 octagon: 1 -16.561,-1.27; 2 -13.792,-1.27; 3 -11.049,-1.27; 4 -8.28,-1.27; 5 -5.512,-1.27; 6 -2.769,-1.27; 7 0,-1.27; 8 2.769,-1.27; 9 5.512,-1.27; 10 8.28,-1.27; 11 11.049,-1.27; 12 13.792,-1.27; 13 16.561,-1.27; 14 -15.189,1.27; 15 -12.421,1.27; 16 -9.652,1.27; 17 -6.909,1.27; 18 -4.14,1.27; 19 -1.372,1.27; 20 1.372,1.27; 21 4.14,1.27; 22 6.909,1.27; 23 9.652,1.27; 24 12.421,1.27; 25 15.189,1.27 | drill 3.302 pad 5.08: G1 -23.52,0; G2 23.52,0
RACON12 = drill 1.194 long: 1 -6.248,2.489; 2 6.248,2.489; 3 -6.248,-2.489; 4 6.248,-2.489
SIL9 = drill 0.813 square: 1 -10.16,0 | drill 0.813: 2 -7.62,0; 3 -5.08,0; 4 -2.54,0; 5 0,0; 6 2.54,0; 7 5.08,0; 8 7.62,0; 9 10.16,0
MA04-2 = drill 1.016 octagon: 1 -3.81,-1.27; 2 -3.81,1.27; 3 -1.27,-1.27; 4 -1.27,1.27; 5 1.27,-1.27; 6 1.27,1.27; 7 3.81,-1.27; 8 3.81,1.27
MA03-1 = drill 1.016 long: 1 -2.54,0; 2 0,0; 3 2.54,0
MA03-2 = drill 1.016: 1 -2.54,-1.27 | drill 1.016 octagon: 2 -2.54,1.27; 3 0,-1.27; 4 0,1.27; 5 2.54,-1.27; 6 2.54,1.27
TL3XPO = drill 1.524 pad 2.032: 1 -2.667,0; 2 0,0; 3 2.667,0
DCK6 = smd 0.85 x 0.35: 1 -1.1,0.65; 2 -1.1,0; 3 -1.1,-0.65; 4 1.1,-0.65; 5 1.1,0; 6 1.1,0.65
VQFN48 = smd 4.2 x 4.2: 0 0,0 | smd 1 x 0.3: 1 -3.5,2.75; 2 -3.5,2.25; 3 -3.5,1.75; 4 -3.5,1.25; 5 -3.5,0.75; 6 -3.5,0.25; 7 -3.5,-0.25; 8 -3.5,-0.75; 9 -3.5,-1.25; 10 -3.5,-1.75; 11 -3.5,-2.25; 12 -3.5,-2.75; 25 3.5,-2.75; 26 3.5,-2.25; 27 3.5,-1.75; 28 3.5,-1.25; 29 3.5,-0.75; 30 3.5,-0.25; 31 3.5,0.25; 32 3.5,0.75; 33 3.5,1.25; 34 3.5,1.75; 35 3.5,2.25; 36 3.5,2.75 | smd 0.3 x 1: 13 -2.75,-3.5; 14 -2.25,-3.5; 15 -1.75,-3.5; 16 -1.25,-3.5; 17 -0.75,-3.5; 18 -0.25,-3.5; 19 0.25,-3.5; 20 0.75,-3.5; 21 1.25,-3.5; 22 1.75,-3.5; 23 2.25,-3.5; 24 2.75,-3.5; 37 2.75,3.5; 38 2.25,3.5; 39 1.75,3.5; 40 1.25,3.5; 41 0.75,3.5; 42 0.25,3.5; 43 -0.25,3.5; 44 -0.75,3.5; 45 -1.25,3.5; 46 -1.75,3.5; 47 -2.25,3.5; 48 -2.75,3.5
DRL5 = smd 0.5 x 0.25: 1 -0.9,0.5; 2 -0.9,0; 3 -0.9,-0.5; 4 0.9,-0.5; 6 0.9,0.5
MB03-1 = drill 1.3 long: 1 -2.54,0; 2 2.54,0
R-PDSO-G16 = smd 0.4 x 1.2: 1 -2.275,-2.9; 2 -1.625,-2.9; 3 -0.975,-2.9; 4 -0.325,-2.9; 5 0.325,-2.9; 6 0.975,-2.9; 7 1.625,-2.9; 8 2.275,-2.9; 9 2.275,2.9; 10 1.625,2.9; 11 0.975,2.9; 12 0.325,2.9; 13 -0.325,2.9; 14 -0.975,2.9; 15 -1.625,2.9; 16 -2.275,2.9

### Placement (x,y rotation side)
1_TO_36  80.64,56.52 270 top
37_TO_72  106.05,31.11 0 top
73_TO_108  131.44,56.52 90 top
144_TO_109  106.05,81.92 180 top
C1  121.28,-16.51 180 top  (outside the outline)
C2  121.28,-10.79 0 bottom  (outside the outline)
C3  34.84,63.62 0 top
C4  24.34,64.11 180 top
C5  34.84,69.61 180 top
C6  123.83,-20.95 270 top  (outside the outline)
C7  116.2,-10.79 180 bottom  (outside the outline)
C8  24.34,70.11 0 top
C9  28.09,73.11 180 top
C10  24.84,46.87 180 top
C11  121.28,-13.97 180 top  (outside the outline)
C12  81.92,-40.64 90 top  (outside the outline)
C13  81.92,-35.56 90 top  (outside the outline)
C14  86.36,-40.64 90 top  (outside the outline)
C15  86.36,-35.56 90 top  (outside the outline)
C16  90.81,-40.64 90 top  (outside the outline)
C17  101.6,-40.64 90 top  (outside the outline)
C18  101.6,-35.56 90 top  (outside the outline)
C19  106.05,-40.64 90 top  (outside the outline)
C20  106.05,-35.56 90 top  (outside the outline)
C21  110.49,-40.64 90 top  (outside the outline)
C22  126.36,-10.79 90 top  (outside the outline)
C23  111.12,-10.79 90 top  (outside the outline)
C24  120.65,-20.95 270 top  (outside the outline)
C25  62.87,73.66 90 top
C26  117.47,-20.95 270 top  (outside the outline)
C27  24.84,40.87 0 top
C28  12.46,69.36 270 top
C29  114.3,-20.95 270 top  (outside the outline)
C30  116.2,-16.51 0 top  (outside the outline)
C31  7.59,58.62 0 top
C32  7.59,62.62 0 top
C33  13.6,56.37 0 top
C34  7.59,54.37 0 top
C35  13.6,52.37 0 top
C36  7.59,50.37 0 top
C37  13.6,48.37 0 top
C38  7.59,46.37 0 top
C39  7.59,42.37 0 top
C40  20.34,42.37 90 top
C41  42.34,68.11 270 top
C42  49.84,61.62 0 top
C43  49.84,57.62 0 top
C44  43.84,56.12 0 top
C45  43.84,51.62 0 top
C46  49.84,49.62 0 top
C47  49.84,45.62 0 top
C48  39.84,42.87 270 top
C49  33.34,47.87 0 top
C50  33.34,41.87 0 top
C51  116.2,-13.97 0 top  (outside the outline)
ENC_0  258.44,51.44 0 top  (outside the outline)
ENC_1  258.44,57.78 0 top  (outside the outline)
ENC_2  258.44,64.14 0 top  (outside the outline)
ENC_3  271.78,57.78 0 top  (outside the outline)
ENC_4  271.78,64.14 0 top  (outside the outline)
ENC_5  154.31,5.71 180 top
ENC_6  167,15.88 180 top
ENC_7  154.31,15.88 180 top
ENC_8  167,5.71 180 top
ENC_9  258.44,64.14 180 top  (outside the outline)
ENC_PR_0_A  268.61,48.26 180 top  (outside the outline)
ENC_PR_0_B  268.61,51.44 180 top  (outside the outline)
ENC_PR_1_A  268.61,54.61 180 top  (outside the outline)
ENC_PR_1_B  268.61,57.78 180 top  (outside the outline)
ENC_PR_2_A  268.61,60.96 180 top  (outside the outline)
ENC_PR_2_B  268.61,64.14 180 top  (outside the outline)
ENC_PR_3_A  281.94,54.61 180 top  (outside the outline)
ENC_PR_3_B  281.94,57.78 180 top  (outside the outline)
ENC_PR_4_A  281.94,60.96 180 top  (outside the outline)
ENC_PR_4_B  281.94,64.14 180 top  (outside the outline)
ENC_PR_5_A  157.48,10.79 0 bottom
ENC_PR_5_B  151.13,10.79 180 bottom
ENC_PR_6_A  151.76,40.64 270 bottom
ENC_PR_6_B  147.96,40.64 270 bottom
ENC_PR_7_A  138.43,38.73 180 bottom
ENC_PR_7_B  138.43,34.92 180 bottom
ENC_PR_8_A  170.18,10.79 0 bottom
ENC_PR_8_B  163.83,10.79 180 bottom
ENC_PR_9_A  248.28,60.96 0 top  (outside the outline)
ENC_PR_9_B  248.28,64.14 0 top  (outside the outline)
L1  34.84,66.61 180 top
L2  24.34,67.11 0 top
L3  24.84,43.87 0 top
L4  33.34,44.87 180 top
LED_0  64.14,61.59 0 top
LED_1  64.14,59.05 0 top
LED_2  64.14,56.52 0 top
LED_3  64.14,53.98 0 top
LED_4  64.14,51.44 0 top
LED_5  64.14,48.9 0 top
LED_6  64.14,46.35 0 top
LED_7  64.14,43.81 0 top
LEFT  92.08,11.43 180 top
R1  63.5,77.47 0 top
R2  62.87,-40.64 90 top  (outside the outline)
R3  3.81,87 90 top
R4  7.62,87 90 top
R5  69.22,-40.64 90 top  (outside the outline)
R6  143.51,-14.61 0 top  (outside the outline)
R7  144.78,-17.78 0 top  (outside the outline)
R8  95.25,-40.64 90 top  (outside the outline)
R9  95.25,-35.56 90 top  (outside the outline)
R10  169.54,-40.64 90 top  (outside the outline)
R11  19.84,65.11 270 top
R12  15.1,69.36 90 top
R13  64.14,64.77 0 top
R17  118.75,-10.79 0 top  (outside the outline)
R18  13.6,64.86 0 top
R19  13.6,60.62 0 top
R20  20.34,58.37 0 top
R21  13.6,44.37 0 top
R22  13.6,40.37 0 top
R23  18.34,42.37 90 top
R24  39.34,65.86 90 top
R25  44.98,68.11 90 top
R26  43.84,63.62 0 top
R27  43.84,59.62 0 top
R28  35.84,37.37 270 top
R29  49.84,53.62 0 top
R30  43.84,47.62 0 top
R31  43.84,43.62 0 top
R32  37.84,42.87 90 top
R33  33.34,37.37 90 top
R34  38.34,55.12 0 top
R35  28.84,37.37 90 top
R36  182.25,-35.56 90 top  (outside the outline)
REAR  182.88,28.57 270 top
RIGHT  -25.4,-175.26 0 top  (outside the outline)
RST  62.87,74.3 180 top
SIL9  58.42,53.98 270 top
STEER_L  28.57,11.43 180 top
STEER_R  -25.4,-124.46 0 top  (outside the outline)
SV1  -14.61,100.33 270 top  (outside the outline)
SV2  142.24,-8.26 90 top  (outside the outline)
SV3  -31.75,-1.27 0 top  (outside the outline)
SV4  147.96,-8.26 90 top  (outside the outline)
SV5  142.88,15.88 180 top
SV6  142.88,5.71 180 top
SV14  196.85,103.5 90 top
SV15  201.93,103.5 90 top  (outside the outline)
SV16  132.72,15.88 180 top
SV17  132.72,5.71 180 top
SV18  59.69,36.2 270 top
SW_0  219.07,62.87 0 top  (outside the outline)
U$1  -19.68,102.87 270 top  (outside the outline)
U$2  29.09,56.62 270 top
U$4  65.41,73.03 180 top
U$5  -19.68,98.42 180 top  (outside the outline)
U$7  5.08,24.13 90 top
U$8  -50.8,59.69 90 top  (outside the outline)
U$9  118.75,-15.88 270 bottom  (outside the outline)
U$10  -52.7,-196.22 0 top  (outside the outline)
U$11  -52.7,-205.1 0 top  (outside the outline)
US_0  184.15,68.58 90 top
US_1  143.51,52.7 270 top
US_2  153.67,52.7 270 top
US_3  163.83,52.7 270 top
US_4  173.99,68.58 90 top
US_5  143.51,68.58 90 top
US_6  153.67,68.58 90 top
US_7  163.83,68.58 90 top
US_PR_0  181.61,78.74 270 top
US_PR_1  140.97,42.55 90 top
US_PR_2  151.13,42.55 90 top
US_PR_3  161.29,42.55 90 top
US_PR_4  171.45,78.74 270 top
US_PR_5  140.97,78.74 270 top
US_PR_6  151.13,78.74 270 top
US_PR_7  161.29,78.74 270 top

### Tracks (layer width: path | path; a pad name or v marks a point on that pad's centre or on a via)
0_A  (1 unrouted)
  Top 0.203: 259.71,50.16 ENC_0.3
0_B  (1 unrouted)
1_A  (1 unrouted)
1_B  (1 unrouted)
2_A  (1 unrouted)
2_B  (1 unrouted)
3_A  (1 unrouted)
3_B  (1 unrouted)
4_A  (1 unrouted)
4_B  (1 unrouted)
5_A
  Bottom 0.203: ENC_5.3 153.03,6.99 156.06,10.01 ENC_PR_5_A.2
5_B
  Bottom 0.203: ENC_5.4 150.5,6.99 152.55,9.04 ENC_PR_5_B.2
6_A
  Bottom 0.203: ENC_6.3 165.74,19.68 165.1,20.32 159.38,20.32 158.75,20.95 158.75,27.3 151.76,34.29 ENC_PR_6_A.2
6_B
  Bottom 0.203: ENC_6.4 163.19,19.05 162.56,19.68 158.75,19.68 158.12,20.32 158.12,26.67 147.96,36.83 ENC_PR_6_B.2
7_A
  Bottom 0.203: ENC_7.3 153.03,27.94 142.24,38.73 ENC_PR_7_A.2
7_B
  Bottom 0.203: ENC_7.4 150.5,29.21 144.78,34.92 ENC_PR_7_B.2
8_A
  Bottom 0.203: ENC_PR_8_A.2 168.76,10.01 165.74,6.99 ENC_8.3
8_B
  Bottom 0.203: ENC_8.4 163.19,6.99 165.1,8.89 165.1,10.01 ENC_PR_8_B.2
9_A  (1 unrouted)
9_B  (1 unrouted)
CS_FL
  Bottom 0.203: LEFT.17 98.98,13.89 99.69,14.61 111.12,14.61 112.94,16.41
CS_ML
  Bottom 0.203: LEFT.19 93.45,14.71 93.98,15.24 110.49,15.24 112.17,16.91
D1_FL
  Top 0.203: 37_TO_72.16 100.97,31.11 100.97,24.77 99.06,22.86 99.06,17.14 100.36,15.85 LEFT.4
D1_ML
  Top 0.203: LEFT.6 94.84,24.36 95.89,25.4 95.89,31.11 37_TO_72.12
D1_RL
  Top 0.203: 37_TO_72.35 167.64,29.84 174.65,36.85 REAR.4
D1_RR
  Top 0.203: 37_TO_72.31 122.56,27.3 123.19,26.67 170.18,26.67 174.85,31.34 REAR.6
D2_FL
  Top 0.203: 37_TO_72.15 102.23,24.13 100.33,22.23 100.33,17.78 101.73,16.38 LEFT.16
D2_ML
  Top 0.203: 37_TO_72.14 98.42,31.11 98.42,26.04 96.22,23.82 LEFT.18
D2_RL
  Top 0.203: 37_TO_72.36 168.91,32.38 174.75,38.23 REAR.16
D2_RR
  Top 0.203: 37_TO_72.34 123.83,31.11 123.83,27.94 124.46,27.3 168.91,27.3 174.32,32.72 REAR.18
E_0  (1 unrouted)
E_1
  Top 0.203: US_1.3 141.6,51.44 140.97,50.8 US_PR_1.2
E_2
  Top 0.203: US_2.3 151.76,51.44 151.13,50.8 US_PR_2.2
E_3
  Top 0.203: US_3.3 161.93,51.44 161.29,50.8 US_PR_3.2
E_4  (1 unrouted)
E_5
  Top 0.203: US_5.3 141.6,69.85 140.97,70.48 US_PR_5.2
E_6
  Top 0.203: US_6.3 151.76,69.85 151.13,70.48 US_PR_6.2
E_7
  Top 0.203: US_7.3 161.93,69.85 161.29,70.48 US_PR_7.2
ENC_5_A
  Bottom 0.203: ENC_PR_5_A.1 158.12,11.58 158.12,12.7 157.48,13.34 148.59,13.34 147.96,13.97 147.96,30.48 146.05,32.38 135.25,32.38 134.62,32.38 133.35,32.38 132.72,33.02 73_TO_108.1
ENC_5_B
  Bottom 0.203: ENC_PR_5_B.1 147.32,13.18 147.32,29.84 145.41,31.75 130.81,31.75 130.18,32.38 73_TO_108.2
ENC_6_A
  Bottom 0.203: 73_TO_108.9 151.13,45.09 151.76,44.45 ENC_PR_6_A.1
ENC_6_B
  Bottom 0.203: 73_TO_108.7 147.47,42.55 ENC_PR_6_B.1
ENC_7_A
  Bottom 0.203: 73_TO_108.3 135.89,37.47 137.16,38.73 ENC_PR_7_A.1
ENC_7_B
  Bottom 0.203: 73_TO_108.4 131.44,36.2 135.25,36.2 136.53,34.92 ENC_PR_7_B.1
ENC_8_A
  Bottom 0.203: ENC_PR_8_A.1 171.45,10.31 171.45,12.7 170.81,13.34 161.29,13.34 160.66,13.97 160.66,18.41 160.02,19.05 158.12,19.05 157.48,19.68 157.48,26.04 141.6,41.91 135.25,41.91 134.62,41.27 131.44,41.27 73_TO_108.8
ENC_8_B
  Bottom 0.203: ENC_PR_8_B.1 160.02,13.18 160.02,17.78 159.38,18.41 157.48,18.41 156.84,19.05 156.84,25.4 140.97,41.27 135.89,41.27 134.62,40.01 73_TO_108.5
ENSW3  (via drill 0.6 pad 1)
  Top 0.203: U$2.27 27.34,49.87 21.84,49.87 v21.84,49.12 | v21.84,38.87 28.77,38.87
  Top 0.3: 28.77,38.87 R35.2
  Bottom 0.203: v21.84,49.12 v21.84,38.87
ENSW4  (via drill 0.6 pad 1)
  Top 0.203: U$2.34 30.84,51.02 v32.15,51.02
  Top 0.3: v33.34,38.87 R33.2
  Bottom 0.203: v32.15,51.02 31.33,51.02 30.71,51.03 30.73,39.12 31.06,38.79 R33.2 v33.34,38.87 33.22,38.73
  Bottom 0.3: 33.3,38.87 v33.34,38.87
GND  (via drill 0.5, 0.6, 0.6 pad 1)  (123 unrouted)
  Top 0.203: 39.52,54.37 45.09,54.37 45.09,55.62 | U$1.2 -19.68,102.87 -21.59,102.87 | 137.16,102.87 135.25,102.87 v135.25,101.6 v133.99,101.6 133.99,102.87 132.08,102.87
  Top 0.3: U$2.7 U$2.8 | U$2.7 28.84,60.37 28.59,60.37 28.34,60.37 | 28.59,60.12 U$2.7 | R34.2 39.52,54.37 | 45.09,55.62 C44.2 | 27.84,55.37 v28.09,55.62 | U$2.7 28.84,59.87 28.34,59.87
  Top 0.305: U$2.21 27.84,55.37
  Top 0.61: 28.59,60.37 28.57,69.22 26.64,69.22 C8.2
  Top 0.8: 33.66,69.85 C5.2
  Top 0.813: SV15.3 SV14.3
  Bottom 0.203: 73_TO_108.20 131.44,56.52 131.44,48.9 73_TO_108.11
  other vias: 29.09,56.62 30.09,57.62 28.09,57.62 30.09,55.62 135.25,99.06 133.99,99.06 29.21,43.18
IN0  (via drill 0.6)
  Top 0.203: v124.46,-14.61 122.69,-14.61 C11.1
  Bottom 0.203: U$9.4 122.88,-15.55 123.83,-14.61 v124.46,-14.61
IN1  (via drill 0.6)
  Top 0.203: v125.73,-15.88 121.92,-15.88 122.05,-16 C1.1
  Bottom 0.203: U$9.5 123.5,-16.2 123.83,-15.88 v125.73,-15.88
IN2  (via drill 0.6)
  Top 0.203: v124.46,-17.14 124.46,-19.68 C6.1
  Bottom 0.203: U$9.6 124.17,-16.85 v124.46,-17.14
IN3  (via drill 0.6)
  Top 0.203: v120.65,-19.68 C24.1
  Bottom 0.203: U$9.7 122.91,-17.5 123.19,-17.78 123.19,-19.05 122.56,-19.68 v120.65,-19.68
IN4  (via drill 0.6)
  Top 0.203: v117.47,-19.68 C26.1
  Bottom 0.203: v117.47,-19.68 119.01,-18.15 U$9.8
IN5  (via drill 0.6)
  Top 0.203: v114.3,-19.68 C29.1
  Bottom 0.203: U$9.9 114.56,-18.15 114.3,-18.41 v114.3,-19.68
IN6  (via drill 0.6)
  Top 0.203: v112.39,-17.78 113.67,-16.51 C30.1
  Bottom 0.203: U$9.10 112.67,-17.5 v112.39,-17.78
IN7  (via drill 0.6)
  Top 0.203: v111.12,-16.51 113.67,-13.97 C51.1
  Bottom 0.203: U$9.11 111.47,-16.85 v111.12,-16.51
LED_0
  Top 0.203: LED_0.C 71.12,61.59 71.75,60.96 71.75,53.34 72.39,52.7 1_TO_36.21
LED_1
  Top 0.203: LED_1.C 70.48,59.05 71.12,58.42 71.12,52.07 71.75,51.44 80.64,51.44 1_TO_36.22
LED_2
  Top 0.203: LED_2.C 69.85,56.52 70.48,55.88 70.48,50.8 71.12,50.16 1_TO_36.23
LED_3
  Top 0.203: LED_3.C 69.22,53.98 69.85,53.34 69.85,49.53 70.48,48.9 80.64,48.9 1_TO_36.24
LED_4
  Top 0.203: LED_4.C 68.58,51.44 69.22,50.8 69.22,45.72 69.85,45.09 1_TO_36.27
LED_5
  Top 0.203: LED_5.C 67.94,48.9 68.58,48.26 68.58,44.45 69.22,43.81 80.64,43.81 1_TO_36.28
LED_6
  Top 0.203: LED_6.C 67.31,46.35 67.94,45.72 67.94,43.18 68.58,42.55 1_TO_36.29
LED_7
  Top 0.203: LED_7.C 65.56,41.76 66.04,41.27 80.64,41.27 1_TO_36.30
MISO_H  (via drill 0.6)  (6 unrouted)
  Top 0.203: STEER_L.9 23.06,20.75 v22.86,20.95 | LEFT.9 86.56,20.75 v86.36,20.95 | 37_TO_72.22 108.58,31.11 108.58,28.57 107.95,27.94 104.14,27.94 103.5,27.3 103.5,23.5 102.23,22.23 102.23,17.78 105.41,14.61 109.86,14.61 110.49,13.97 110.49,6.99 111.12,6.35 121.92,6.35 122.56,6.99 122.56,18.41 123.19,19.05 170.18,19.05 174.19,23.06 REAR.9
  Bottom 0.203: v22.86,20.95 v86.36,20.95 86.36,20.91
  other vias: 102.23,20.95
MISO_S  (1 unrouted)
  Top 0.203: U$5.3 -16.01,98.92 SV1.5
MOSI_H  (via drill 0.6)  (4 unrouted)
  Top 0.203: STEER_L.21 24.43,19.38 v24.13,19.68 | LEFT.21 87.94,19.38 v87.63,19.68 | 37_TO_72.21 109.86,27.94 109.22,27.3 104.78,27.3 104.14,26.67 104.14,21.59 103.5,20.95 v103.5,19.68 103.5,17.78 106.05,15.24 110.49,15.24 111.12,14.61 111.12,7.62 111.76,6.99 121.28,6.99 121.92,7.62 121.92,19.05 122.56,19.68 169.54,19.68 173.35,23.5 179.07,23.5 180.01,24.43 REAR.21
  Bottom 0.203: v24.13,19.68 v87.63,19.68 v103.5,19.68 104.78,19.68 105.5,20.41
MOSI_S  (1 unrouted)
  Top 0.203: U$5.6 -20.59,97.42 -19.68,96.52 -18.41,96.52 -17.14,97.79 -14.61,97.79 SV1.6
N$1
  Top 0.203: 80.64,56.52 73.03,56.52 72.39,57.15 72.39,69.85 71.75,70.48
N$3
  Top 1.143: C4.1 27.34,64.11 U$2.10
  Top 1.3: L2.2 C4.1
N$4  (1 unrouted)
N$10
  Top 0.203: U$2.1 31.84,61.87 36.09,61.87 36.09,63.62
  Top 0.3: 36.09,63.62 C3.2
N$11
  Top 1.143: U$2.3 30.84,63.62 C3.1
  Top 1.3: C3.1 L1.2
N$12
  Top 0.203: U$2.12 26.34,62.37 23.09,62.37 23.09,63.62
  Top 0.3: 23.09,63.62 C4.2
N$13
  Top 0.3: 26.34,48.62 26.34,47.37 C10.1
  Top 0.305: U$2.29 28.34,48.62 26.34,48.62
  Top 0.8: C10.1 L3.2
N$14
  Top 0.203: U$2.28 27.84,49.12 23.59,49.12 23.59,47.37
  Top 0.3: 23.59,47.37 C10.2
N$16
  Top 0.203: U$2.13 25.09,59.37 25.09,61.87 19.84,61.87 R11.2
N$17
  Top 0.203: U$2.14 24.59,58.87 24.59,61.37 17.77,61.37 17.77,64.86 R18.2 | R12.1 15.1,64.36
  Top 0.3: C28.2 14.85,67.94 R12.1 | 15.1,64.36 R18.2
N$18
  Top 0.203: 17.02,60.62 17.02,62.62 C32.2 | 17.02,60.62 24.09,60.62 24.09,58.37 U$2.15 | 17.02,60.62 R19.2
N$19
  Top 0.203: LED_0.A SIL9.2
N$21
  Top 0.203: SIL9.6 LED_4.A
N$22
  Top 0.203: SIL9.8 LED_6.A
N$23
  Top 0.203: LED_1.A SIL9.3
N$24
  Top 0.203: SIL9.5 LED_3.A
N$25
  Top 0.203: SIL9.7 LED_5.A
N$26
  Top 0.203: LED_7.A SIL9.9
N$27
  Top 0.203: R19.1 12.17,58.62 C31.2
N$28  (1 unrouted)
  Top 0.203: R13.1 62.87,64.92
N$29
  Top 0.203: U$2.17 22.59,57.37 22.59,58.37 R20.2
  Top 0.3: 21.59,58.37 R20.2
N$31  (5 unrouted)
N$35
  Top 0.203: U$2.18 16.59,56.87 16.59,54.37 C34.2
N$36
  Top 0.203: U$2.19 17.09,56.37 17.09,52.37 C35.2
N$37
  Top 0.203: R21.1 8.85,44.37 8.85,42.37
  Top 0.3: 8.85,42.37 C39.2
N$38
  Top 0.203: U$2.26 26.84,50.62 20.59,50.62 20.59,43.87 | 16.59,43.87 16.59,43.79 | R22.2 16.59,40.37 16.59,43.79 | 16.59,43.79 R23.2
  Top 0.8: 20.59,43.87 20.34,43.87 C40.2 18.34,43.77 R23.2
N$39
  Top 0.203: C38.2 15.1,46.37 | 15.1,46.37 15.1,44.37 | U$2.25 26.34,51.62 19.34,51.62 19.34,46.37 15.1,46.37
  Top 0.3: 15.1,44.37 R21.2
N$40
  Top 0.203: U$2.48 33.09,59.37 33.09,61.12 39.34,61.12 R24.1
N$41
  Top 0.203: U$2.24 24.34,53.87 24.34,52.62 18.09,52.62 18.09,48.37 C37.2
N$44
  Top 0.203: U$2.16 23.59,57.87 23.59,59.87 17.09,59.87 17.09,58.37 15.1,58.37 15.1,56.37
  Top 0.3: 14.85,56.37 C33.2 15.1,56.37
N$47
  Top 0.203: R27.2 48.59,59.62 48.59,61.62
  Top 0.3: 48.59,61.62 C42.1
N$54
  Top 0.203: 48.42,53.37 34.09,53.37 34.09,54.37 U$2.38
  Top 0.3: R29.1 48.42,53.37
N$55
  Top 0.203: U$2.35 31.34,51.87 37.09,51.87 37.09,44.79 | R31.1 42.42,44.2 40.09,44.2 | C48.1 39.88,44.3 39.88,44.62
  Top 0.3: 37.09,44.79 R32.2
  Top 0.8: 40.09,44.62 39.88,44.62 38.17,44.62 R32.2
  Top 0.813: 40.09,44.2 40.09,44.62
N$57
  Top 0.3: U$2.32 29.84,49.62 31.84,49.62 31.84,47.87 C49.1
  Top 0.8: C49.1 L4.2
N$58
  Top 0.203: U$2.47 33.59,58.87 33.59,60.62 39.84,60.62 39.84,61.62 42.34,61.62 42.34,63.62
  Top 0.3: 42.34,63.62 R26.1
  Top 0.8: R26.1 42.42,66.72 C41.2 42.34,66.69 R25.1
N$59
  Top 0.203: U$2.37 33.59,53.87 33.59,52.87 38.09,52.87 38.09,51.62 C45.1
N$60
  Top 0.203: C46.1 42.34,49.62 | 42.34,49.62 42.34,47.62 | U$2.36 31.84,52.37 37.59,52.37 37.59,49.62 42.34,49.62
  Top 0.3: 42.34,47.62 R30.1
N$61
  Top 0.203: R30.2 48.34,47.62 48.34,45.62
  Top 0.3: 48.34,45.62 C47.1
N$62
  Top 0.203: 48.45,57.87 42.84,57.87 42.84,59.62 | U$2.46 34.09,58.37 34.09,59.62 R27.1
  Top 0.3: C43.1 48.45,57.87 | 42.84,59.62 R27.1
N$63
  Top 0.203: U$2.45 41.95,57.87 41.95,55.62
  Top 0.3: C44.1 41.95,55.62 41.84,55.62
N$65
  Top 0.203: U$2.33 30.34,50.12 34.84,50.12 34.84,47.37
  Top 0.3: 34.84,47.37 C49.2
N$66
  Top 0.203: U$2.40 36.42,55.37
  Top 0.3: 36.42,55.37 R34.1
POT_0
  Top 0.203: 186.69,104.14 193.68,104.14 194.31,103.5 SV14.2
POT_1
  Top 0.203: 186.06,103.5 193.04,103.5 194.31,102.23 199.39,102.23 200.66,103.5 SV15.2
PWM_FL
  Top 0.203: LEFT.5 97.59,23.29 99.69,25.4 37_TO_72.13
PWM_ML
  Top 0.203: LEFT.7 92.08,22.86 94.61,25.4 37_TO_72.9
PWM_RL
  Top 0.203: 37_TO_72.33 125.09,28.57 125.73,27.94 168.28,27.94 174.42,34.09 REAR.5
PWM_RR
  Top 0.203: 37_TO_72.32 121.28,31.11 121.28,26.67 121.92,26.04 172.09,26.04 174.62,28.57 REAR.7
RST  (4 unrouted)
RST_N  (via drill 0.6 pad 1)
  Top 0.203: U$2.39 35.09,54.87 v35.09,54.37
  Top 0.3: v36.09,39.12 R28.1
  Bottom 0.203: 35.09,39.12 | 35.09,39.12 35.05,39.12 | 35.09,39.12 36.32,39.12 36.32,52.58 35.09,53.55 v35.09,54.37
  Bottom 0.3: 35.09,39.12 v36.09,39.12
RX  (1 unrouted)
SCK_H  (via drill 0.6)  (4 unrouted)
  Top 0.203: STEER_L.22 21.67,18.34 v21.59,18.41 | LEFT.22 v85.17,18.34 | 37_TO_72.24 111.12,31.11 111.12,27.3 110.49,26.67 105.41,26.67 104.78,26.04 v104.78,18.41 104.78,17.78 106.68,15.88 111.12,15.88 111.76,15.24 111.76,8.26 112.39,7.62 120.65,7.62 121.28,8.26 121.28,19.68 121.92,20.32 168.91,20.32 v170.18,21.59 | REAR.22 v176.53,21.67
  Bottom 0.203: v21.59,18.41 85.09,18.41 | 85.09,18.41 v104.78,18.41 106.28,19.91 | v85.17,18.34 85.09,18.41 | v170.18,21.59 175.9,21.59 v176.53,21.67
SCK_S  (1 unrouted)
  Top 0.203: U$1.6 -19.04,101.6 SV1.3
SCL_H  (via drill 0.6)  (2 unrouted)
  Top 0.203: STEER_L.23 18.92,23.37 v19.05,23.5 | LEFT.23 82.42,23.37 v82.55,23.5 | REAR.23 173.99,18.92 v173.99,19.05 | v106.05,23.5 106.68,24.13 158.75,24.13 v160.66,22.23
  Bottom 0.203: v19.05,23.5 v82.55,23.5 104.78,23.5 | 104.78,23.5 37_TO_72.17 | 104.78,23.5 v106.05,23.5 | v160.66,22.23 167,22.23 167.64,21.59 167.64,20.32 168.91,19.05 v173.99,19.05
SCL_S  (3 unrouted)
  Top 0.203: U$1.1 -19.04,104.14 SV1.1 | 1_TO_36.2 80.64,79.38
SCS_FL
  Bottom 0.203: STEER_L.17 35.48,15.16 36.2,15.88 109.86,15.88 111.39,17.41
SCS_RL
  Bottom 0.203: STEER_L.19 29.95,15.98 30.48,16.51 109.22,16.51 110.62,17.91
SD1_FL
  Top 0.203: 37_TO_72.5 89.53,26.67 88.9,26.04 37.47,26.04 36.85,25.43 STEER_L.4
SD1_RL
  Top 0.203: 37_TO_72.4 85.72,31.11 85.72,28.57 85.09,27.94 32.38,27.94 31.34,26.9 STEER_L.6
SD2_FL
  Top 0.203: 37_TO_72.8 90.81,31.11 90.81,26.04 90.17,25.4 38.73,25.4 38.23,24.89 STEER_L.16
SD2_RL
  Top 0.203: 37_TO_72.3 87,27.94 86.36,27.3 33.66,27.3 32.72,26.36 STEER_L.18
SDA_H  (via drill 0.6)  (2 unrouted)
  Top 0.203: STEER_L.10 20.3,22.2 v20.32,22.23 | LEFT.10 v83.8,22.2 | REAR.10 175.26,20.3 v175.26,20.32 | v160.66,24.13 160.02,24.77 106.68,24.77 v106.05,25.4
  Bottom 0.203: v20.32,22.23 83.82,22.23 | 83.82,22.23 107.31,22.23 107.31,24.77 | v83.8,22.2 83.82,22.23 | 107.31,24.77 37_TO_72.19 | v106.05,25.4 106.68,24.77 107.31,24.77 | v175.26,20.32 168.91,20.32 168.28,20.95 168.28,23.5 167.64,24.13 v160.66,24.13
SDA_S  (4 unrouted)
SIL10
  Top 0.203: SIL9.4 LED_2.A
SPWM_FL
  Top 0.203: 37_TO_72.6 88.27,31.11 88.27,27.3 87.63,26.67 34.92,26.67 34.09,25.83 STEER_L.5
SPWM_RL
  Top 0.203: STEER_L.7 28.57,27.3 29.84,28.57 81.92,28.57 83.19,29.84
  Top 0.254: 37_TO_72.1 83.19,29.84
SS_H_1  (1 unrouted)
SS_H_3  (via drill 0.6)
  Top 0.203: 37_TO_72.30 118.75,31.11 118.75,26.04 119.38,25.4 v178.44,25.4 | v178.44,17.53 REAR.11
  Bottom 0.203: v178.44,25.4 v178.44,17.53
SS_H_4
  Top 0.203: LEFT.11 81.03,23.88 81.92,24.77 91.44,24.77 92.08,25.4 37_TO_72.7
SS_H_6
  Top 0.203: STEER_L.11 17.53,28.32 18.41,29.21 81.28,29.21 37_TO_72.2
SS_S  (1 unrouted)
  Top 0.203: U$1.4 -20.32,101.75 -20.32,100.97 -19.68,100.33 -14.61,100.33 SV1.4
SW_0  (1 unrouted)
TCK  (1 unrouted)
  Top 0.203: 59.69,34.92 SV18.3
TDI  (1 unrouted)
  Top 0.203: 1_TO_36.34 80.64,36.2
TDO  (1 unrouted)
  Top 0.203: 1_TO_36.36 80.64,33.66 62.23,33.66
TMS  (1 unrouted)
  Top 0.203: 59.69,37.47 SV18.1
TX  (1 unrouted)
US_E_0  (1 unrouted)
  Top 0.203: 73_TO_108.21 135.25,60.33 135.89,60.96 135.89,83.82 136.53,84.45 180.97,84.45 181.61,83.82 181.61,82.55
US_E_1
  Top 0.203: 73_TO_108.13 135.89,50.16 136.53,49.53 136.53,41.91 137.31,41.12 US_PR_1.1
US_E_2
  Top 0.203: 73_TO_108.14 131.44,48.9 135.25,48.9 135.89,48.26 135.89,39.37 136.53,38.73 150.5,38.73 151.13,39.37 US_PR_2.1
US_E_3
  Top 0.203: US_PR_3.1 161.44,40.49 161.44,38.89 160.66,38.1 135.89,38.1 135.25,38.73 135.25,45.72 134.62,46.35 131.44,46.35 73_TO_108.12
US_E_4
  Top 0.203: 73_TO_108.22 131.44,59.05 135.89,59.05 136.53,59.69 136.53,83.19 137.16,83.82 170.81,83.82 171.45,83.19 US_PR_4.1
US_E_5
  Top 0.203: 73_TO_108.16 131.44,51.44 137.79,51.44 138.43,52.07 138.43,79.38 139.22,80.16 US_PR_5.1
US_E_6
  Top 0.203: 73_TO_108.15 137.16,52.7 137.79,53.34 137.79,81.92 138.43,82.55 150.5,82.55 151.13,81.92 US_PR_6.1
US_E_7
  Top 0.203: 73_TO_108.19 136.53,57.78 137.16,58.42 137.16,82.55 137.79,83.19 160.66,83.19 161.29,82.55 US_PR_7.1
US_T_0  (1 unrouted)
US_T_1  (1 unrouted)
  Top 0.203: US_1.2 145.41,53.98 146.05,54.61 146.05,59.05 146.69,59.69 188.59,59.69 189.23,60.33 189.23,87 188.59,87.63 132.08,87.63
US_T_2  (1 unrouted)
  Top 0.203: US_2.2 155.57,53.98 156.21,54.61 156.21,58.42 156.84,59.05 189.23,59.05 189.87,59.69 189.87,87.63 189.23,88.27 132.08,88.27
US_T_3  (1 unrouted)
  Top 0.203: US_3.2 165.74,53.98 166.37,54.61 166.37,57.78 167,58.42 189.87,58.42 190.5,59.05 190.5,88.27 189.87,88.9 132.08,88.9
US_T_4  (1 unrouted)
  Top 0.203: US_4.2 175.9,67.31 176.53,66.67 176.53,62.87 177.16,62.23 186.06,62.23 186.69,62.87 186.69,84.45 186.06,85.09 132.08,85.09
US_T_5  (1 unrouted)
  Top 0.203: US_5.2 145.41,67.31 146.05,66.67 146.05,60.96 146.69,60.33 187.96,60.33 188.59,60.96 188.59,86.36 187.96,87 132.08,87
US_T_6  (1 unrouted)
  Top 0.203: US_6.2 155.57,67.31 156.21,66.67 156.21,61.59 156.84,60.96 187.32,60.96 187.96,61.59 187.96,85.72 187.32,86.36 132.08,86.36
US_T_7  (1 unrouted)
  Top 0.203: US_7.2 165.74,67.31 166.37,66.67 166.37,62.23 167,61.59 186.69,61.59 187.32,62.23 187.32,85.09 186.69,85.72 132.08,85.72
V24_D  (5 unrouted)
  Top 0.813: 105.41,10.16 LEFT.15 105.87,11.53 | 105.41,10.16 107.31,10.16 107.31,2.54 174.62,2.54 176.53,5.08 176.53,7.62 178.44,9.53 187.32,9.53 189.23,11.43 189.23,43.81 183.51,43.81 | 105.41,10.16 105.41,10.79 106.68,10.79 106.68,11.43 106.05,11.43 106.05,11.71 | REAR.14 182.98,43.76 REAR.1 181.61,45.09 | REAR.15 182.78,42.37 REAR.2 181.61,43.81 | 181.61,45.09 182.88,43.81 183.51,43.81 | 105.87,11.53 LEFT.2 | LEFT.14 107.26,11.33 LEFT.1 106.05,12.7 106.05,12.06 | 105.87,11.53 106.05,11.71 | 106.05,11.71 106.05,12.06 | 106.05,12.06 107.31,12.06 | 183.51,43.81 183.51,42.55 | 183.51,41.91 183.51,42.55 | 183.51,42.55 182.88,42.55 182.88,43.18 182.25,43.18 182.25,43.81 181.61,43.81 | 181.61,43.81 181.61,45.09
V24_S  (4 unrouted)
  Top 0.813: STEER_L.14 43.76,11.33 STEER_L.1 42.55,12.7 | STEER_L.2 42.37,12.52 | STEER_L.15 42.37,11.53 42.37,12.52 | 42.37,12.52 42.55,12.7 | 41.27,10.16 STEER_L.14 | STEER_L.14 43.81,10.16 43.81,10.79 42.55,10.79 | 41.91,10.79 42.55,10.79 | 42.55,10.79 42.55,11.43 43.18,11.43 43.81,12.06 42.55,12.06 42.55,12.7 | U$7.1 9.53,17.14 9.53,5.71 12.06,3.17 41.27,3.17 43.81,5.71 43.76,5.77 STEER_L.14
VA  (4 unrouted)
  Bottom 0.203: U$9.2 120.02,-14.25 120.02,-12.32 125.73,-12.32 C22.+
VCC  (16 unrouted)
  Top 0.203: C8.1 15.1,70.11
  Top 0.3: 15.1,70.11 R12.2 14.85,70.77 C28.1
  Top 0.406: L2.1 22.86,67.2 | SV17.1 135.25,8.26 158.12,8.26 | 158.12,8.26 ENC_5.1 | 158.12,8.26 170.81,8.26 | 170.81,8.26 ENC_8.1 | 170.81,8.26 170.81,13.34 | SV16.1 135.25,13.34 158.12,13.34 | 158.12,13.34 ENC_7.1 | ENC_6.1 170.81,13.34 | 170.81,13.34 158.12,13.34
  Top 0.813: 22.86,67.2 22.86,74.93
  Top 1.3: L2.1 C8.1
  Bottom 0.813: 189.23,100.97 SV14.1 SV15.1
VCCINT  (via drill 0.6 pad 1.27)  (4 unrouted)
  Top 0.8: L4.1 C50.2 37.84,41.87 R32.1 39.82,41.44 C48.2
  Bottom 0.813: C48.2 39.84,39.21 43.18,35.88
  other vias: 39.84,41.47
VCCIO  (via drill 0.6, 0.6 pad 1.27)  (16 unrouted)
  Top 0.203: 44.34,69.61 C5.1 | R4.2 7.62,88.9
  Top 0.254: 37_TO_72.10 93.34,31.11 93.34,25.4 89.31,21.36 LEFT.8
  Top 0.3: R25.2 44.34,69.61
  Top 0.305: v163.19,103.5 v128.27,103.5 v93.34,103.5 v58.42,103.5 v23.5,103.5 23.5,89.53 22.86,88.9 v20.32,88.9
  Top 0.8: R25.2 44.34,69.52 C41.1
  Top 0.813: v40.92,74.3 C5.1 | R3.2 4.29,88.9 7.62,88.9 v20.32,88.9
  Top 1.3: L1.1 C5.1
  Bottom 0.203: 130.23,45.09 73_TO_108.10
  Bottom 0.305: REAR.8 REAR.20 | REAR.20 184.15,27.3 | REAR.20 189.23,27.3 189.23,11.43 187.32,9.53 178.44,9.53 176.53,7.62 176.53,5.08 174.62,2.54 90.7,2.54 | 90.7,2.54 LEFT.20 LEFT.8 | 90.7,2.54 27.2,3.17 STEER_L.20 STEER_L.8
  Bottom 0.813: v20.32,88.9 66.04,88.9 67.31,87.63
VCORE
  Top 0.3: 20.34,41.62 C40.1
  Top 0.8: L3.1 C27.1 23.45,41.62 | 20.84,40.87 20.84,40.97 C40.1 20.34,40.94 R23.1
  Top 0.813: C27.1 20.84,40.87
VD  (4 unrouted)
  Bottom 0.203: U$9.13 117.47,-15.55 117.47,-12.32 111.76,-12.32 C23.+
VDDD  (via drill 0.6 pad 1)
  Top 0.203: U$2.20 18.84,55.87 | 18.84,55.87 17.59,55.87 17.59,50.37 C36.2 | v18.84,54.12 18.84,55.87 | 33.09,35.62 28.59,35.62 v28.7,35.68
  Top 0.3: R20.1 v18.84,58.37 | 33.09,35.62 33.09,36.19 R33.1 | R35.1 28.59,35.62 | R24.2 v39.34,67.36 | 19.34,66.61 19.34,66.54 R11.1 19.84,66.61 19.34,66.61
  Top 0.305: v17.59,66.61 19.34,66.61
  Top 0.8: R28.2 R33.1
  Bottom 0.203: 18.84,66.61 v18.84,58.37 v18.84,54.12 18.84,51.23 26.24,51.23 27.94,49.53 27.94,35.56 28.7,35.56 v28.7,35.68
  Bottom 0.3: v28.7,35.68 28.8,35.62 | v39.34,67.36 39.34,68.75 | 18.84,68.75 18.84,66.61
  Bottom 0.305: v17.59,66.61 18.84,66.61 | 39.34,68.75 18.84,68.75
VIN  (via drill 0.8 pad 1.27)
  Top 0.203: U$2.22 23.48,54.87 v22.73,54.12
  Top 0.3: U$2.30 28.84,52.87 29.34,52.87 U$2.31 29.34,53.37 28.84,53.37 U$2.30 | U$2.6 U$2.5 | U$2.5 29.84,60.37 29.59,60.37 29.34,60.37 | 29.34,60.37 29.34,59.87 29.84,59.87 U$2.5 | 29.34,60.37 29.59,60.32 29.59,65.34 | U$2.30 29.09,53.12
  Top 0.61: 29.59,60.37 29.59,65.34 | 29.59,65.34 29.59,72.61 | v31.09,65.34 29.59,65.34 | 29.09,53.12 v29.09,47.12
  Top 0.8: 29.41,72.61 C9.1 | 29.59,72.61 C9.1 | 29.59,73.11 C9.1
  Bottom 0.61: v31.09,65.34 29.59,65.34 29.59,59.62 | 26.09,59.62 26.09,54.87 | v29.09,47.12 29.09,53.62 26.09,53.62 26.09,54.87 | 26.09,54.87 23.48,54.87 v22.73,54.12
  Bottom 0.8: 29.59,59.62 26.09,59.62